# EAGLE design Control_unit (EAGLE 9.4.2)
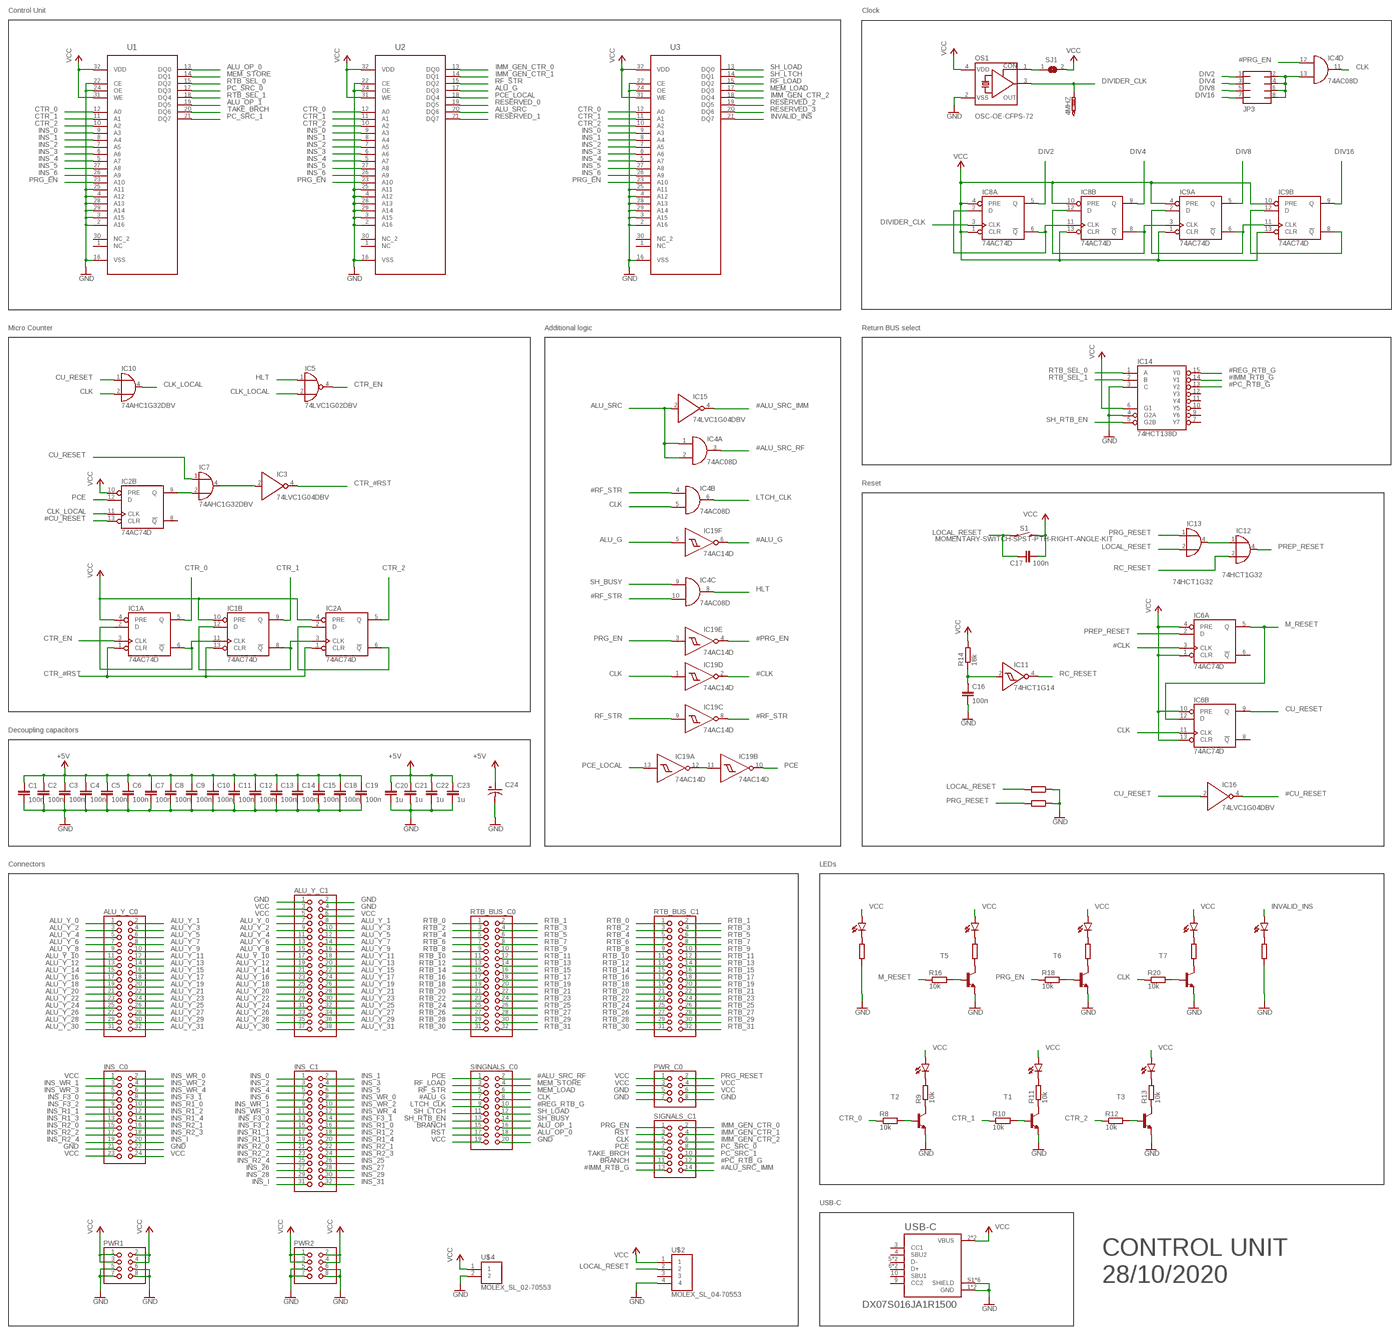
[diagram p0: schematic, sheet 1, overview]
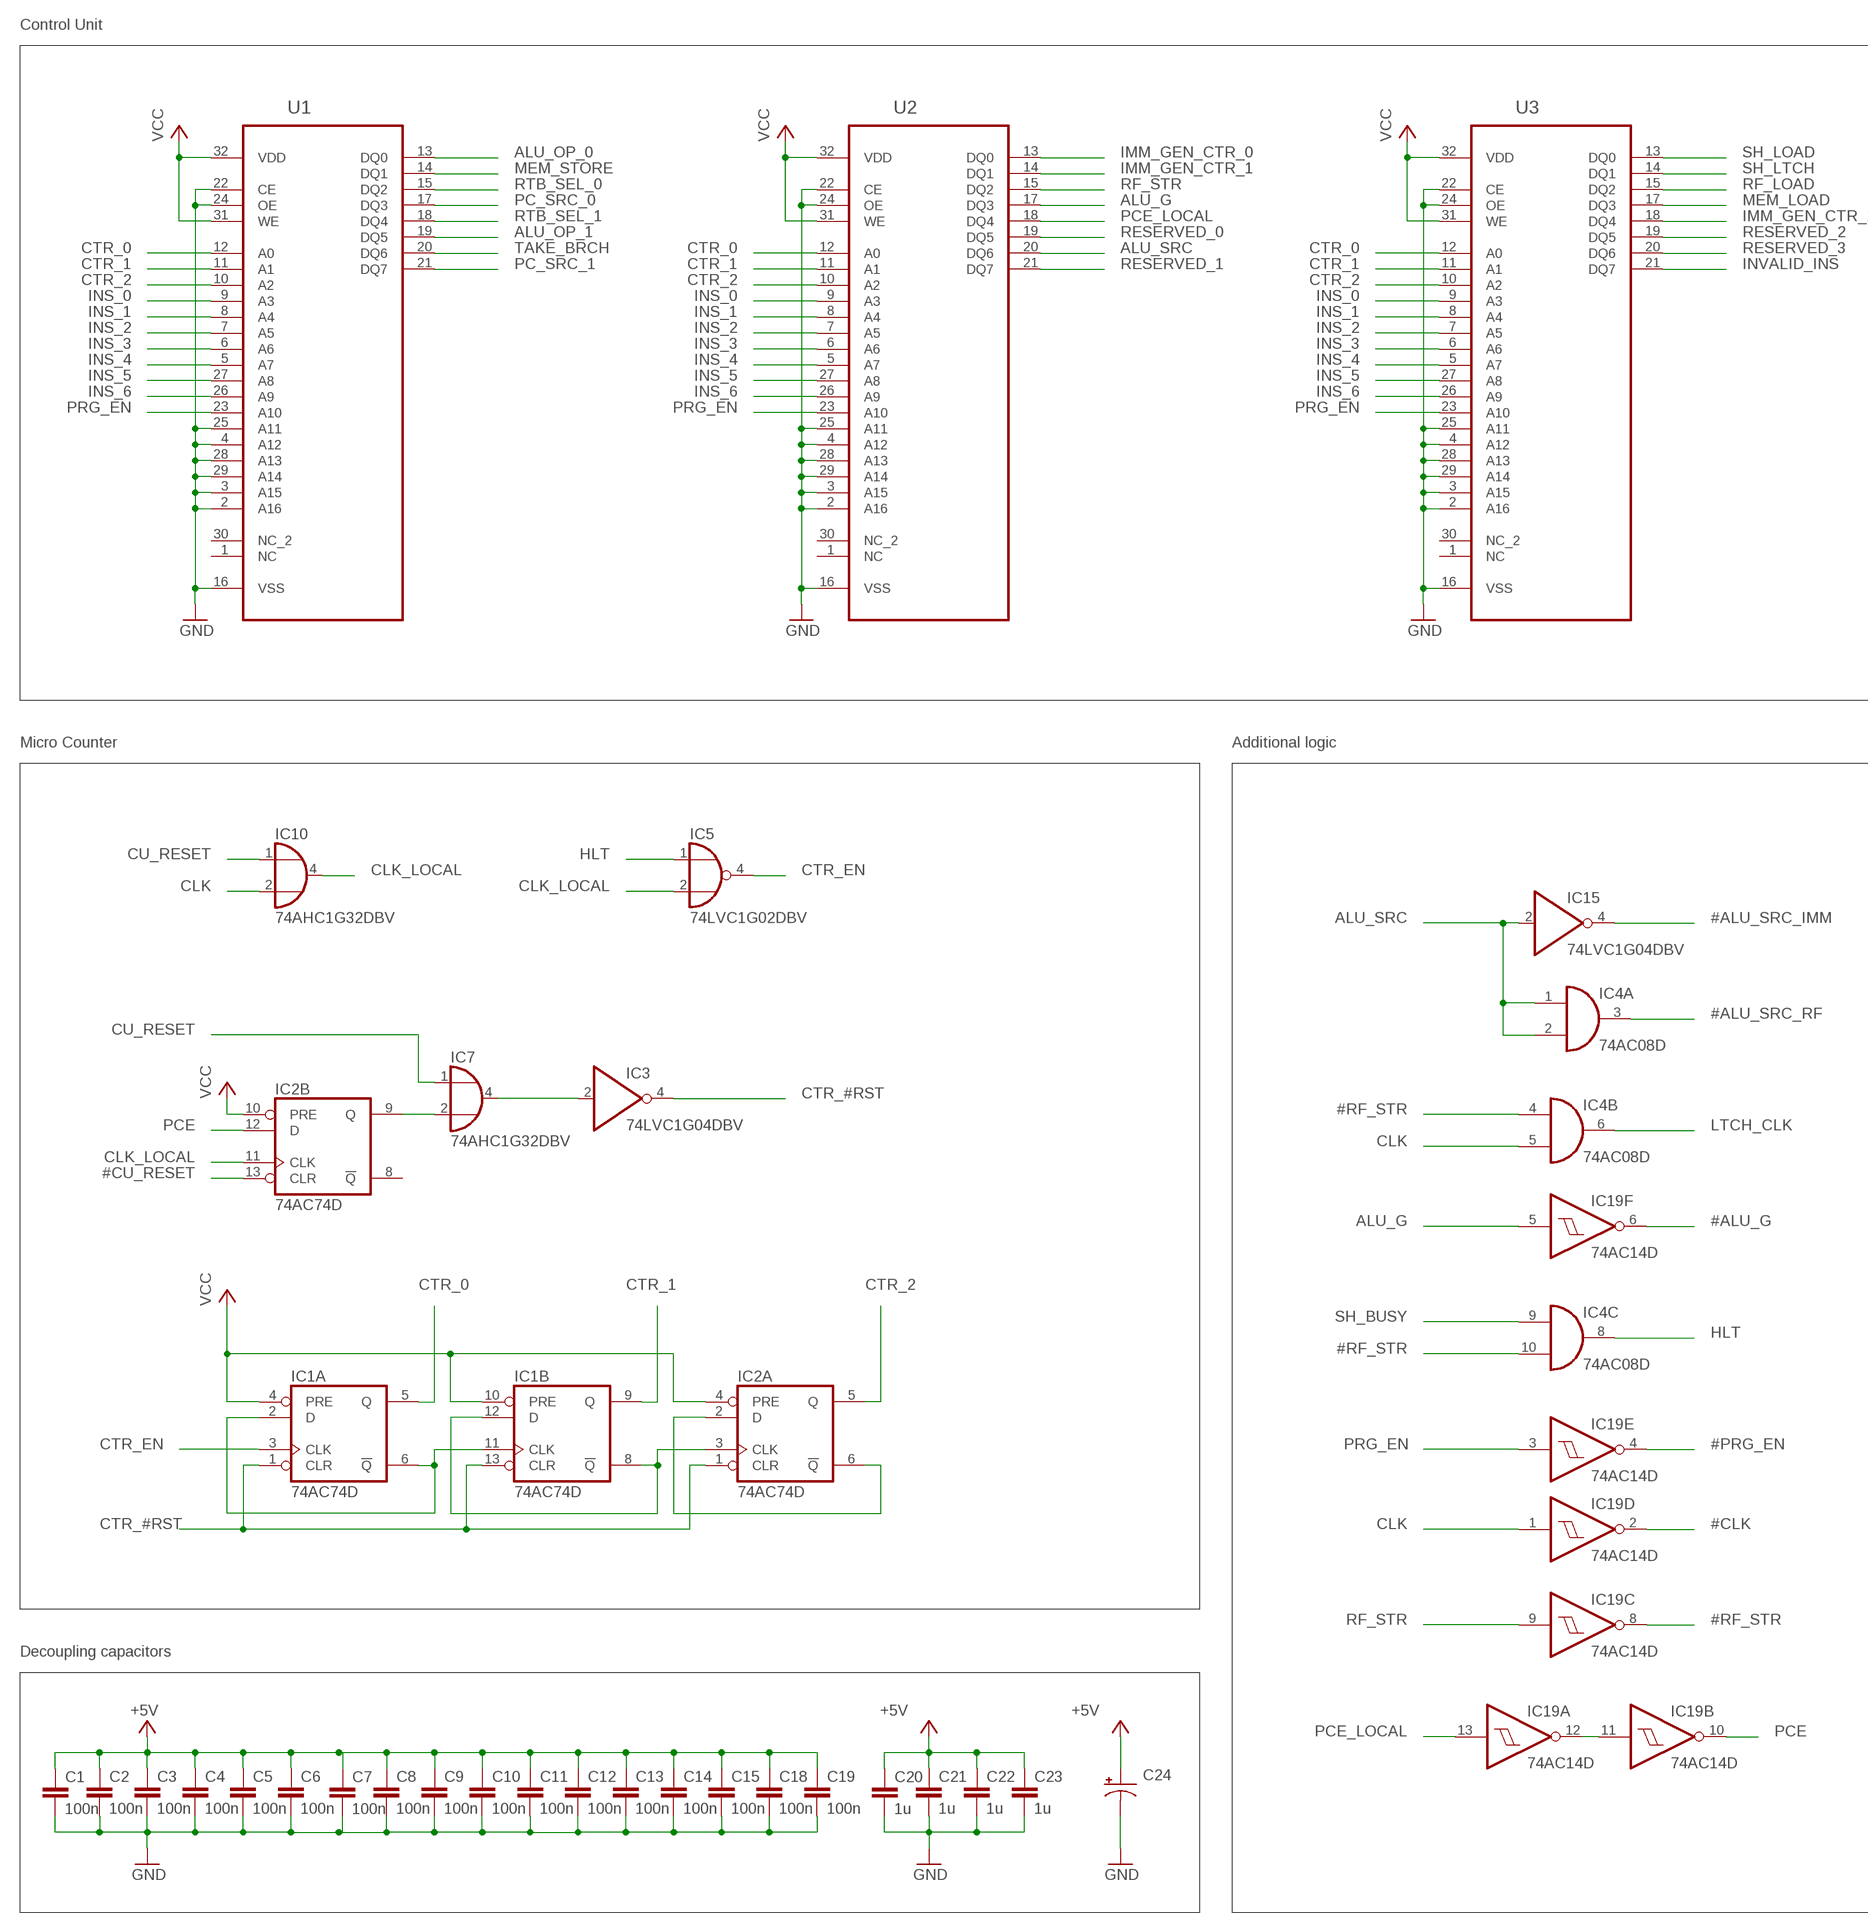
[diagram p1: schematic, sheet 1, part 1 of 4]
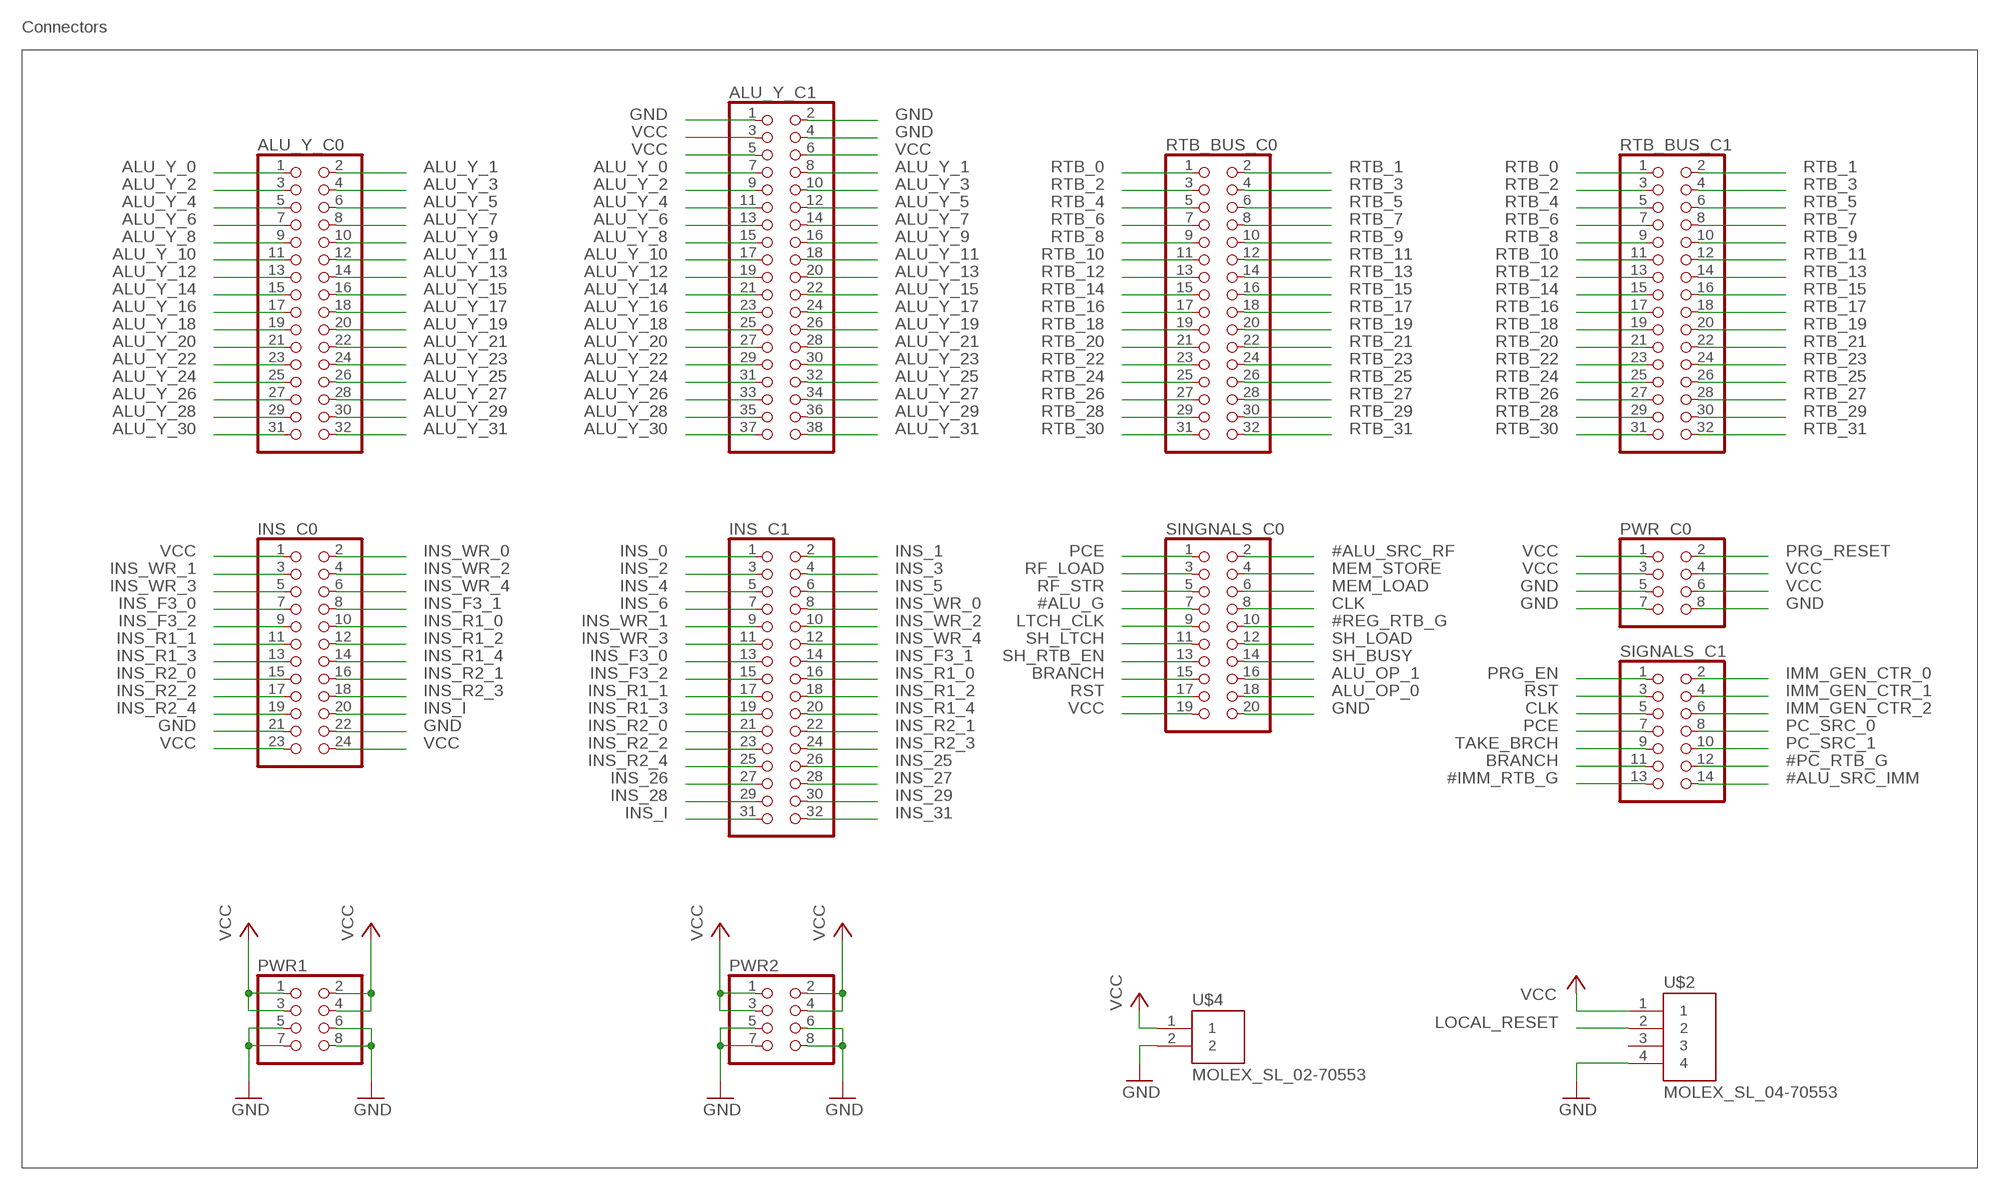
[diagram p2: schematic, sheet 1, part 2 of 4]
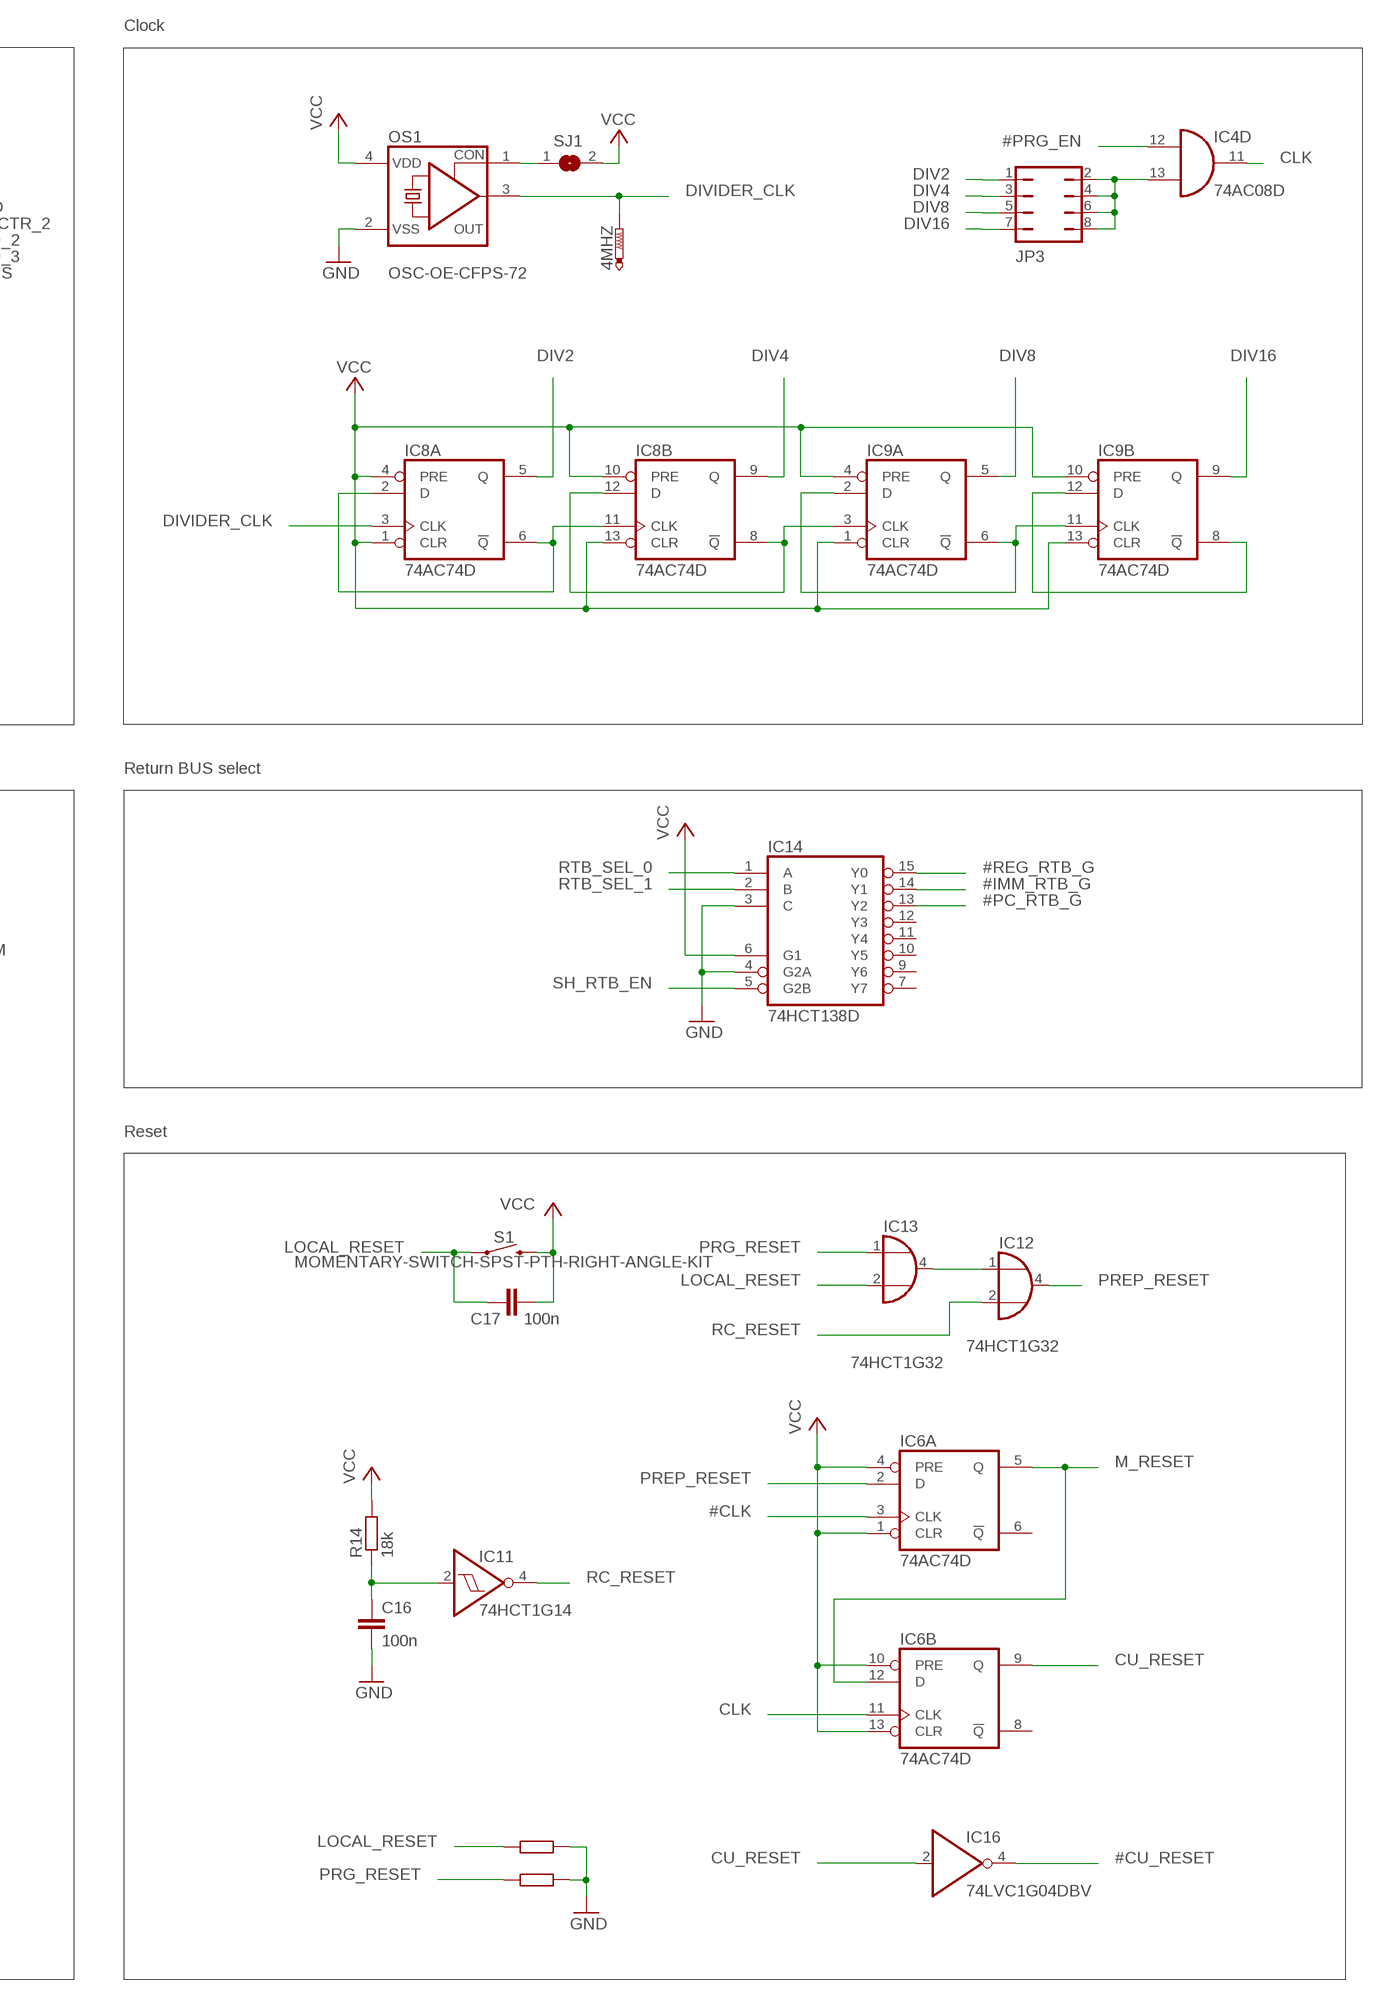
[diagram p3: schematic, sheet 1, part 3 of 4]
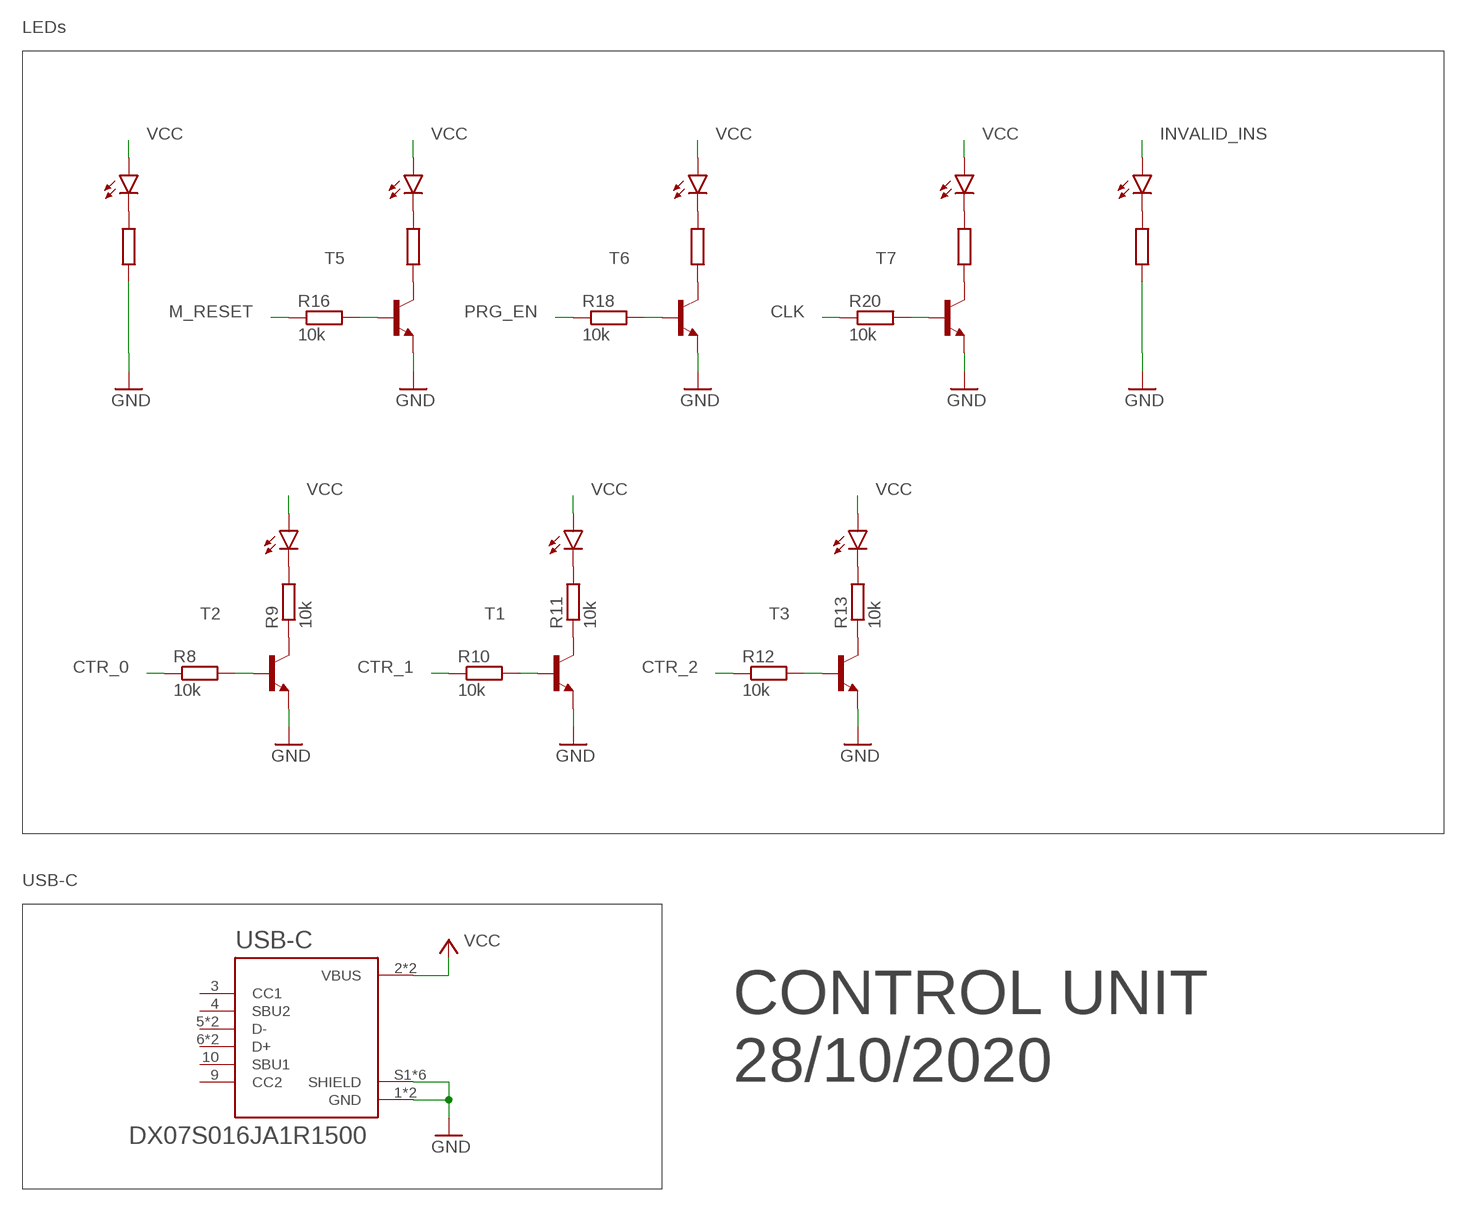
[diagram p4: schematic, sheet 1, part 4 of 4]

## Parts
4MHZ  PTR1B2,54  [B2,54]
ALU_Y_C0  PINHD-2X16  [2X16]
ALU_Y_C1  PINHD-2X19  [2X19]
C1  100n  C-EUC0805  [C0805]
C2  100n  C-EUC0805  [C0805]
C3  100n  C-EUC0805  [C0805]
C4  100n  C-EUC0805  [C0805]
C5  100n  C-EUC0805  [C0805]
C6  100n  C-EUC0805  [C0805]
C7  100n  C-EUC0805  [C0805]
C8  100n  C-EUC0805  [C0805]
C9  100n  C-EUC0805  [C0805]
C10  100n  C-EUC0805  [C0805]
C11  100n  C-EUC0805  [C0805]
C12  100n  C-EUC0805  [C0805]
C13  100n  C-EUC0805  [C0805]
C14  100n  C-EUC0805  [C0805]
C15  100n  C-EUC0805  [C0805]
C16  100n  C-EUC0805  [C0805]
C17  100n  C-EUC0805  [C0805]
C18  100n  C-EUC0805  [C0805]
C19  100n  C-EUC0805  [C0805]
C20  1u  C-EUC0805  [C0805]
C21  1u  C-EUC0805  [C0805]
C22  1u  C-EUC0805  [C0805]
C23  1u  C-EUC0805  [C0805]
C24  CAPACITOR-P153CLV-1010  [153CLV-1010]
IC1  74AC74D  [SO14]
IC2  74AC74D  [SO14]
IC3  74LVC1G04DBV  [SOT23-5]
IC4  74AC08D  [SO14]
IC5  74LVC1G02DBV  [SOT23-5]
IC6  74AC74D  [SO14]
IC7  74AHC1G32DBV  [SOT23-5]
IC8  74AC74D  [SO14]
IC9  74AC74D  [SO14]
IC10  74AHC1G32DBV  [SOT23-5]
IC11  74HCT1G14  74AHC1G14DBV  [SOT23-5]
IC12  74HCT1G32  74AHC1G32DBV  [SOT23-5]
IC13  74HCT1G32  74AHC1G32DBV  [SOT23-5]
IC14  74HCT138D  [SO16]
IC15  74LVC1G04DBV  [SOT23-5]
IC16  74LVC1G04DBV  [SOT23-5]
IC19  74AC14D  [SO14]
INS_C0  PINHD-2X12  [2X12]
INS_C1  PINHD-2X16  [2X16]
JP3  JP4Q  [JP4Q]
LED1  LEDSML0805  [SML0805]
LED2  LEDSML0805  [SML0805]
LED3  LEDSML0805  [SML0805]
LED4  LEDSML0805  [SML0805]
LED5  LEDSML0805  [SML0805]
LED6  LEDSML0805  [SML0805]
LED7  LEDSML0805  [SML0805]
LED8  LEDSML0805  [SML0805]
OS1  OSC-OE-CFPS-72  [7.2X5.2-4-PAD]
PWR1  PINHD-2X4  [2X04]
PWR2  PINHD-2X4  [2X04]
PWR_C0  PINHD-2X4  [2X04]
R1  10k  R-EU_M0805  [M0805]
R2  10k  R-EU_M0805  [M0805]
R3  1k  R-EU_M0805  [M0805]
R4  1k  R-EU_M0805  [M0805]
R5  1k  R-EU_M0805  [M0805]
R6  1k  R-EU_M0805  [M0805]
R7  1k  R-EU_M0805  [M0805]
R8  10k  R-EU_M0805  [M0805]
R9  10k  R-EU_M0805  [M0805]
R10  10k  R-EU_M0805  [M0805]
R11  10k  R-EU_M0805  [M0805]
R12  10k  R-EU_M0805  [M0805]
R13  10k  R-EU_M0805  [M0805]
R14  18k  R-EU_M0805  [M0805]
R16  10k  R-EU_M0805  [M0805]
R18  10k  R-EU_M0805  [M0805]
R20  10k  R-EU_M0805  [M0805]
RTB_BUS_C0  PINHD-2X16  [2X16]
RTB_BUS_C1  PINHD-2X16  [2X16]
S1  MOMENTARY-SWITCH-SPST-PTH-RIGHT-ANGLE-KIT  [TACTILE_SWITCH_PTH_RIGHT_ANGLE_KIT]
SIGNALS_C1  PINHD-2X7  [2X07]
SINGNALS_C0  PINHD-2X10  [2X10]
SJ1  SJ  [SJ]
T1  MMBT4401LT1-NPN-SOT23-BEC  [SOT23-BEC]
T2  MMBT4401LT1-NPN-SOT23-BEC  [SOT23-BEC]
T3  MMBT4401LT1-NPN-SOT23-BEC  [SOT23-BEC]
T5  MMBT4401LT1-NPN-SOT23-BEC  [SOT23-BEC]
T6  MMBT4401LT1-NPN-SOT23-BEC  [SOT23-BEC]
T7  MMBT4401LT1-NPN-SOT23-BEC  [SOT23-BEC]
U1  SST39SF010A-70-4I-NHEPLCC32  [S32]
U2  SST39SF010A-70-4I-NHEPLCC32  [S32]
U3  SST39SF010A-70-4I-NHEPLCC32  [S32]
U$2  MOLEX_SL_04-70553  [SL_70553_4]
U$4  MOLEX_SL_02-70553  [SL_70553_2]
USB-C  DX07S016JA1R1500  [JAE_DX07S016JA1R1500]

## Nets
#ALU_G: IC19.6(F:O) SINGNALS_C0.7
#ALU_SRC_IMM: IC15.4(O) SIGNALS_C1.14
#ALU_SRC_RF: IC4.3(A:O) SINGNALS_C0.2
#CLK: IC6.3(A:CLK) IC19.2(D:O)
#CU_RESET: IC2.13(B:CLR) IC16.4(O)
#IMM_RTB_G: IC14.14(Y1) SIGNALS_C1.13
#PC_RTB_G: IC14.13(Y2) SIGNALS_C1.12
#PRG_EN: IC4.12(D:I0) IC19.4(E:O)
#REG_RTB_G: IC14.15(Y0) SINGNALS_C0.10
#RF_STR: IC4.4(B:I0) IC4.10(C:I1) IC19.8(C:O)
ALU_G: IC19.5(F:I) U2.17(DQ3)
ALU_OP_0: SINGNALS_C0.18 U1.13(DQ0)
ALU_OP_1: SINGNALS_C0.16 U1.19(DQ5)
ALU_SRC: IC4.1(A:I0) IC4.2(A:I1) IC15.2(I) U2.20(DQ6)
ALU_Y_0: ALU_Y_C0.1 ALU_Y_C1.7
ALU_Y_1: ALU_Y_C0.2 ALU_Y_C1.8
ALU_Y_2: ALU_Y_C0.3 ALU_Y_C1.9
ALU_Y_3: ALU_Y_C0.4 ALU_Y_C1.10
ALU_Y_4: ALU_Y_C0.5 ALU_Y_C1.11
ALU_Y_5: ALU_Y_C0.6 ALU_Y_C1.12
ALU_Y_6: ALU_Y_C0.7 ALU_Y_C1.13
ALU_Y_7: ALU_Y_C0.8 ALU_Y_C1.14
ALU_Y_8: ALU_Y_C0.9 ALU_Y_C1.15
ALU_Y_9: ALU_Y_C0.10 ALU_Y_C1.16
ALU_Y_10: ALU_Y_C0.11 ALU_Y_C1.17
ALU_Y_11: ALU_Y_C0.12 ALU_Y_C1.18
ALU_Y_12: ALU_Y_C0.13 ALU_Y_C1.19
ALU_Y_13: ALU_Y_C0.14 ALU_Y_C1.20
ALU_Y_14: ALU_Y_C0.15 ALU_Y_C1.21
ALU_Y_15: ALU_Y_C0.16 ALU_Y_C1.22
ALU_Y_16: ALU_Y_C0.17 ALU_Y_C1.23
ALU_Y_17: ALU_Y_C0.18 ALU_Y_C1.24
ALU_Y_18: ALU_Y_C0.19 ALU_Y_C1.25
ALU_Y_19: ALU_Y_C0.20 ALU_Y_C1.26
ALU_Y_20: ALU_Y_C0.21 ALU_Y_C1.27
ALU_Y_21: ALU_Y_C0.22 ALU_Y_C1.28
ALU_Y_22: ALU_Y_C0.23 ALU_Y_C1.29
ALU_Y_23: ALU_Y_C0.24 ALU_Y_C1.30
ALU_Y_24: ALU_Y_C0.25 ALU_Y_C1.31
ALU_Y_25: ALU_Y_C0.26 ALU_Y_C1.32
ALU_Y_26: ALU_Y_C0.27 ALU_Y_C1.33
ALU_Y_27: ALU_Y_C0.28 ALU_Y_C1.34
ALU_Y_28: ALU_Y_C0.29 ALU_Y_C1.35
ALU_Y_29: ALU_Y_C0.30 ALU_Y_C1.36
ALU_Y_30: ALU_Y_C0.31 ALU_Y_C1.37
ALU_Y_31: ALU_Y_C0.32 ALU_Y_C1.38
BRANCH: SIGNALS_C1.11 SINGNALS_C0.15
CLK: IC4.5(B:I1) IC4.11(D:O) IC6.11(B:CLK) IC10.2(I1) IC19.1(D:I) R20.1 SIGNALS_C1.5 SINGNALS_C0.8
CLK_LOCAL: IC2.11(B:CLK) IC5.2(I1) IC10.4(O)
CTR_0: IC1.5(A:Q) R8.1 U1.12(A0) U2.12(A0) U3.12(A0)
CTR_1: IC1.9(B:Q) R10.1 U1.11(A1) U2.11(A1) U3.11(A1)
CTR_2: IC2.5(A:Q) R12.1 U1.10(A2) U2.10(A2) U3.10(A2)
CTR_#RST: IC1.1(A:CLR) IC1.13(B:CLR) IC2.1(A:CLR) IC3.4(O)
CTR_EN: IC1.3(A:CLK) IC5.4(O)
CU_RESET: IC6.9(B:Q) IC7.1(I0) IC10.1(I0) IC16.2(I)
DIV2: IC8.5(A:Q) JP3.1
DIV4: IC8.9(B:Q) JP3.3
DIV8: IC9.5(A:Q) JP3.5
DIV16: IC9.9(B:Q) JP3.7
DIVIDER_CLK: 4MHZ.TP IC8.3(A:CLK) OS1.3(OUT)
GND: ALU_Y_C1.1 ALU_Y_C1.2 ALU_Y_C1.4 C1.2 C2.2 C3.2 C4.2 C5.2 C6.2 C7.2 C8.2 C9.2 C10.2 C11.2 C12.2 C13.2 C14.2 C15.2 C16.2 C18.2 C19.2 C20.2 C21.2 C22.2 C23.2 C24.- IC14.3(C) IC14.4(G2A) INS_C0.21 INS_C0.22 OS1.2(VSS) PWR1.5 PWR1.6 PWR1.7 PWR1.8 PWR2.5 PWR2.6 PWR2.7 PWR2.8 PWR_C0.5 PWR_C0.7 PWR_C0.8 R1.1 R2.1 R3.1 R7.1 SINGNALS_C0.20 T1.E T2.E T3.E T5.E T6.E T7.E U1.2(A16) U1.3(A15) U1.4(A12) U1.16(VSS) U1.22(CE) U1.24(OE) U1.25(A11) U1.28(A13) U1.29(A14) U2.2(A16) U2.3(A15) U2.4(A12) U2.16(VSS) U2.22(CE) U2.24(OE) U2.25(A11) U2.28(A13) U2.29(A14) U3.2(A16) U3.3(A15) U3.4(A12) U3.16(VSS) U3.22(CE) U3.24(OE) U3.25(A11) U3.28(A13) U3.29(A14) U$2.4 U$4.2 USB-C.1(GND) USB-C.12(GND) USB-C.S1(SHIELD) USB-C.S2(SHIELD) USB-C.S3(SHIELD) USB-C.S4(SHIELD) USB-C.S5(SHIELD) USB-C.S6(SHIELD)
HLT: IC4.8(C:O) IC5.1(I0)
IMM_GEN_CTR_0: SIGNALS_C1.2 U2.13(DQ0)
IMM_GEN_CTR_1: SIGNALS_C1.4 U2.14(DQ1)
IMM_GEN_CTR_2: SIGNALS_C1.6 U3.18(DQ4)
INS_0: INS_C1.1 U1.9(A3) U2.9(A3) U3.9(A3)
INS_1: INS_C1.2 U1.8(A4) U2.8(A4) U3.8(A4)
INS_2: INS_C1.3 U1.7(A5) U2.7(A5) U3.7(A5)
INS_3: INS_C1.4 U1.6(A6) U2.6(A6) U3.6(A6)
INS_4: INS_C1.5 U1.5(A7) U2.5(A7) U3.5(A7)
INS_5: INS_C1.6 U1.27(A8) U2.27(A8) U3.27(A8)
INS_6: INS_C1.7 U1.26(A9) U2.26(A9) U3.26(A9)
INS_25: INS_C1.26
INS_26: INS_C1.27
INS_27: INS_C1.28
INS_28: INS_C1.29
INS_29: INS_C1.30
INS_31: INS_C1.32
INS_F3_0: INS_C0.7 INS_C1.13
INS_F3_1: INS_C0.8 INS_C1.14
INS_F3_2: INS_C0.9 INS_C1.15
INS_I: INS_C0.20 INS_C1.31
INS_R1_0: INS_C0.10 INS_C1.16
INS_R1_1: INS_C0.11 INS_C1.17
INS_R1_2: INS_C0.12 INS_C1.18
INS_R1_3: INS_C0.13 INS_C1.19
INS_R1_4: INS_C0.14 INS_C1.20
INS_R2_0: INS_C0.15 INS_C1.21
INS_R2_1: INS_C0.16 INS_C1.22
INS_R2_2: INS_C0.17 INS_C1.23
INS_R2_3: INS_C0.18 INS_C1.24
INS_R2_4: INS_C0.19 INS_C1.25
INS_WR_0: INS_C0.2 INS_C1.8
INS_WR_1: INS_C0.3 INS_C1.9
INS_WR_2: INS_C0.4 INS_C1.10
INS_WR_3: INS_C0.5 INS_C1.11
INS_WR_4: INS_C0.6 INS_C1.12
INVALID_INS: LED5.A U3.21(DQ7)
LOCAL_RESET: C17.1 IC13.2(I1) R1.2 S1.1 U$2.2
LTCH_CLK: IC4.6(B:O) SINGNALS_C0.9
M_RESET: IC6.5(A:Q) IC6.12(B:D) R16.1
MEM_LOAD: SINGNALS_C0.6 U3.17(DQ3)
MEM_STORE: SINGNALS_C0.4 U1.14(DQ1)
N$1: IC1.2(A:D) IC1.6(A:!Q) IC1.11(B:CLK)
N$2: IC12.1(I0) IC13.4(O)
N$3: IC2.9(B:Q) IC7.2(I1)
N$4: IC3.2(I) IC7.4(O)
N$5: IC19.11(B:I) IC19.12(A:O)
N$6: IC8.2(A:D) IC8.6(A:!Q) IC8.11(B:CLK)
N$7: IC1.8(B:!Q) IC1.12(B:D) IC2.3(A:CLK)
N$8: R4.1 T5.C
N$9: IC2.2(A:D) IC2.6(A:!Q)
N$10: R5.1 T6.C
N$11: R6.1 T7.C
N$12: LED1.C R3.2
N$14: R8.2 T2.B
N$15: LED8.C R9.2
N$16: IC8.8(B:!Q) IC8.12(B:D) IC9.3(A:CLK)
N$17: LED2.C R4.2
N$18: LED3.C R5.2
N$19: R9.1 T2.C
N$20: R10.2 T1.B
N$21: LED6.C R11.2
N$22: R11.1 T1.C
N$23: R12.2 T3.B
N$24: LED7.C R13.2
N$25: R13.1 T3.C
N$26: R16.2 T5.B
N$27: LED4.C R6.2
N$28: LED5.C R7.2
N$29: R18.2 T6.B
N$30: IC9.2(A:D) IC9.6(A:!Q) IC9.11(B:CLK)
N$31: IC9.8(B:!Q) IC9.12(B:D)
N$32: R20.2 T7.B
N$33: C16.1 IC11.2(I) R14.1
N$34: OS1.1(CON) SJ1.1
N$35: IC4.13(D:I1) JP3.2 JP3.4 JP3.6 JP3.8
PC_SRC_0: SIGNALS_C1.8 U1.17(DQ3)
PC_SRC_1: SIGNALS_C1.10 U1.21(DQ7)
PCE: IC2.12(B:D) IC19.10(B:O) SIGNALS_C1.7 SINGNALS_C0.1
PCE_LOCAL: IC19.13(A:I) U2.18(DQ4)
PREP_RESET: IC6.2(A:D) IC12.4(O)
PRG_EN: IC19.3(E:I) R18.1 SIGNALS_C1.1 U1.23(A10) U2.23(A10) U3.23(A10)
PRG_RESET: IC13.1(I0) PWR_C0.2 R2.2
RC_RESET: IC11.4(O) IC12.2(I1)
RESERVED_0: U2.19(DQ5)
RESERVED_1: U2.21(DQ7)
RESERVED_2: U3.19(DQ5)
RESERVED_3: U3.20(DQ6)
RF_LOAD: SINGNALS_C0.3 U3.15(DQ2)
RF_STR: IC19.9(C:I) SINGNALS_C0.5 U2.15(DQ2)
RST: SIGNALS_C1.3 SINGNALS_C0.17
RTB_0: RTB_BUS_C0.1 RTB_BUS_C1.1
RTB_1: RTB_BUS_C0.2 RTB_BUS_C1.2
RTB_2: RTB_BUS_C0.3 RTB_BUS_C1.3
RTB_3: RTB_BUS_C0.4 RTB_BUS_C1.4
RTB_4: RTB_BUS_C0.5 RTB_BUS_C1.5
RTB_5: RTB_BUS_C0.6 RTB_BUS_C1.6
RTB_6: RTB_BUS_C0.7 RTB_BUS_C1.7
RTB_7: RTB_BUS_C0.8 RTB_BUS_C1.8
RTB_8: RTB_BUS_C0.9 RTB_BUS_C1.9
RTB_9: RTB_BUS_C0.10 RTB_BUS_C1.10
RTB_10: RTB_BUS_C0.11 RTB_BUS_C1.11
RTB_11: RTB_BUS_C0.12 RTB_BUS_C1.12
RTB_12: RTB_BUS_C0.13 RTB_BUS_C1.13
RTB_13: RTB_BUS_C0.14 RTB_BUS_C1.14
RTB_14: RTB_BUS_C0.15 RTB_BUS_C1.15
RTB_15: RTB_BUS_C0.16 RTB_BUS_C1.16
RTB_16: RTB_BUS_C0.17 RTB_BUS_C1.17
RTB_17: RTB_BUS_C0.18 RTB_BUS_C1.18
RTB_18: RTB_BUS_C0.19 RTB_BUS_C1.19
RTB_19: RTB_BUS_C0.20 RTB_BUS_C1.20
RTB_20: RTB_BUS_C0.21 RTB_BUS_C1.21
RTB_21: RTB_BUS_C0.22 RTB_BUS_C1.22
RTB_22: RTB_BUS_C0.23 RTB_BUS_C1.23
RTB_23: RTB_BUS_C0.24 RTB_BUS_C1.24
RTB_24: RTB_BUS_C0.25 RTB_BUS_C1.25
RTB_25: RTB_BUS_C0.26 RTB_BUS_C1.26
RTB_26: RTB_BUS_C0.27 RTB_BUS_C1.27
RTB_27: RTB_BUS_C0.28 RTB_BUS_C1.28
RTB_28: RTB_BUS_C0.29 RTB_BUS_C1.29
RTB_29: RTB_BUS_C0.30 RTB_BUS_C1.30
RTB_30: RTB_BUS_C0.31 RTB_BUS_C1.31
RTB_31: RTB_BUS_C0.32 RTB_BUS_C1.32
RTB_SEL_0: IC14.1(A) U1.15(DQ2)
RTB_SEL_1: IC14.2(B) U1.18(DQ4)
SH_BUSY: IC4.9(C:I0) SINGNALS_C0.14
SH_LOAD: SINGNALS_C0.12 U3.13(DQ0)
SH_LTCH: SINGNALS_C0.11 U3.14(DQ1)
SH_RTB_EN: IC14.5(G2B) SINGNALS_C0.13
TAKE_BRCH: SIGNALS_C1.9 U1.20(DQ6)
VCC: ALU_Y_C1.3 ALU_Y_C1.5 ALU_Y_C1.6 C1.1 C2.1 C3.1 C4.1 C5.1 C6.1 C7.1 C8.1 C9.1 C10.1 C11.1 C12.1 C13.1 C14.1 C15.1 C17.2 C18.1 C19.1 C20.1 C21.1 C22.1 C23.1 C24.+ IC1.4(A:PRE) IC1.10(B:PRE) IC2.4(A:PRE) IC2.10(B:PRE) IC6.1(A:CLR) IC6.4(A:PRE) IC6.10(B:PRE) IC6.13(B:CLR) IC8.1(A:CLR) IC8.4(A:PRE) IC8.10(B:PRE) IC8.13(B:CLR) IC9.1(A:CLR) IC9.4(A:PRE) IC9.10(B:PRE) IC9.13(B:CLR) IC14.6(G1) INS_C0.1 INS_C0.23 INS_C0.24 LED1.A LED2.A LED3.A LED4.A LED6.A LED7.A LED8.A OS1.4(VDD) PWR1.1 PWR1.2 PWR1.3 PWR1.4 PWR2.1 PWR2.2 PWR2.3 PWR2.4 PWR_C0.1 PWR_C0.3 PWR_C0.4 PWR_C0.6 R14.2 S1.2 SINGNALS_C0.19 SJ1.2 U1.31(WE) U1.32(VDD) U2.31(WE) U2.32(VDD) U3.31(WE) U3.32(VDD) U$2.1 U$4.1 USB-C.2(VBUS) USB-C.11(VBUS) ; supply symbol labelled +5V
Unconnected: IC2.8(B:!Q) IC6.6(A:!Q) IC6.8(B:!Q) IC14.7(Y7) IC14.9(Y6) IC14.10(Y5) IC14.11(Y4) IC14.12(Y3) U1.1(NC) U1.30(NC_2) U2.1(NC) U2.30(NC_2) U3.1(NC) U3.30(NC_2) U$2.3 USB-C.3(CC1) USB-C.4(SBU2) USB-C.5(D-) USB-C.6(D+) USB-C.7(D+) USB-C.8(D-) USB-C.9(CC2) USB-C.10(SBU1)

## Notes on the sheet
- Control Unit | Clock
- Micro Counter | Additional logic | Return BUS select
- Reset
- Decoupling capacitors
- Connectors | LEDs
- USB-C
- CONTROL UNIT
  28/10/2020

## Power pins joined to a net without a drawn wire
GND: IC1.7(P:GND) IC2.7(P:GND) IC3.3(GND) IC4.7(P:GND) IC5.3(GND) IC6.7(P:GND) IC7.3(GND) IC8.7(P:GND) IC9.7(P:GND) IC10.3(GND) IC11.3(GND) IC12.3(GND) IC13.3(GND) IC14.8(GND) IC15.3(GND) IC16.3(GND) IC19.7(P:GND)
VCC: IC1.14(P:VCC) IC2.14(P:VCC) IC3.5(VCC) IC4.14(P:VCC) IC5.5(VCC) IC6.14(P:VCC) IC7.5(VCC) IC8.14(P:VCC) IC9.14(P:VCC) IC10.5(VCC) IC11.5(VCC) IC12.5(VCC) IC13.5(VCC) IC14.16(VCC) IC15.5(VCC) IC16.5(VCC) IC19.14(P:VCC)

## Library data of the parts
4MHZ = testpad:PTR1: TEST PIN
ALU_Y_C0 RTB_BUS_C1 = pinhead:PINHD-2X16: PIN HEADER
ALU_Y_C1 = pinhead_bottom:PINHD-2X19: PIN HEADER
C1-C23 = rcl:C-EU: CAPACITOR, European symbol; SPICEPREFIX: C
C24 = BeagleBone_Blue_R3:CAPACITOR-P: POLARIZED CAPACITOR, American symbol
IC1 IC2 IC6 IC8 IC9 = AAA__74xx-eu:74*74: Dual D type positive edge triggered FLIP FLOP, preset and clear
IC3 IC15 IC16 = 74xx-little-de:74*1G04: INVERTER Gate
IC4 = 74xx-eu:74*08: Quad 2-input AND gate
IC5 = 74xx-little-de:74*1G02: 2-input NOR gate
IC7 IC10 IC12 IC13 = 74xx-little-de:74*1G32: 2-input OR gate
IC11 = 74xx-little-de:74*1G14: Single Schmitt-Trigger Inverter Gate
IC14 = 74xx-eu:74*138: 3-line to 8-line DECODER/DEMULTIPLEXER
IC19 = 74xx-eu:74*14: Hex schmitt trigger INVERTER
INS_C0 = pinhead:PINHD-2X12: PIN HEADER
INS_C1 RTB_BUS_C0 = pinhead_bottom:PINHD-2X16: PIN HEADER
JP3 = jumper:JP4Q: JUMPER
LED1-LED8 = led:LED: LED OSRAM: - CHIPLED LG R971, LG N971, LY N971, LG Q971, LY Q971, LO R971, LY R971 LH N974, LH R974 LS Q976, LO Q976, LY Q976 LO Q996 - Hyper CHIPLED LW Q18S LB Q993, LB Q99A, LB R99A - SideLED LS A670, LO A670, LY A670, LG A670, LP A670 LB A673, LV A673, LT A673, LW A673 LH A674 LY A675 LS A676, LA A676, LO A676, LY A676, LW A676 LS A679, LY A679, LG A679 - Hyper Micro SIDELED® LS Y876, LA Y876, LO Y876, LY Y876 LT Y87S - SmartLED LW L88C, LW L88S LB L89C, LB L89S, LG L890 LS L89K, LO L89K, LY L89K LS L896, LA L896, LO L896, LY L896 - TOPLED LS T670, LO T670, LY T670, LG T670, LP T670 LSG T670, LSP T670, LSY T670, LOP T670, LYG T670 LG T671, LOG T671, LSG T671 LB T673, LV T673, LT T673, LW T673 LH T674 LS T676, LA T676, LO T676, LY T676, LB T676, LH T676, LSB T676, LW T676 LB T67C, LV T67C, LT T67C, LS T67K, LO T67K, LY T67K, LW E67C LS E67B, LA E67B, LO E67B, LY E67B, LB E67C, LV E67C, LT E67C LW T67C LS T679, LY T679, LG T679 LS T770, LO T770, LY T770, LG T770, LP T770 LB T773, LV T773, LT T773, LW T773 LH T774 LS E675, LA E675, LY E675, LS T675 LS T776, LA T776, LO T776, LY T776, LB T776 LHGB T686 LT T68C, LB T68C - Hyper Mini TOPLED® LB M676 - Mini TOPLED Santana® LG M470 LS M47K, LO M47K, LY M47K Source: http://www.osram.convergy.de LUXEON: - LUMILED® LXK2-PW12-R00, LXK2-PW12-S00, LXK2-PW14-U00, LXK2-PW14-V00 LXK2-PM12-R00, LXK2-PM12-S00, LXK2-PM14-U00 LXK2-PE12-Q00, LXK2-PE12-R00, LXK2-PE12-S00, LXK2-PE14-T00, LXK2-PE14-U00 LXK2-PB12-K00, LXK2-PB12-L00, LXK2-PB12-M00, LXK2-PB14-N00, LXK2-PB14-P00, LXK2-PB14-Q00 LXK2-PR12-L00, LXK2-PR12-M00, LXK2-PR14-Q00, LXK2-PR14-R00 LXK2-PD12-Q00, LXK2-PD12-R00, LXK2-PD12-S00 LXK2-PH12-R00, LXK2-PH12-S00 LXK2-PL12-P00, LXK2-PL12-Q00, LXK2-PL12-R00 Source: www.luxeon.com KINGBRIGHT: KA-3528ASYC Source: www.kingbright.com
OS1 = IQD-Frequency-Products:OSC-OE: OSCILLATOR WITH OE
PWR1 PWR2 = pinhead:PINHD-2X4: PIN HEADER
PWR_C0 = pinhead_bottom:PINHD-2X4: PIN HEADER
R1-R14 R16 R18 R20 = rcl:R-EU_: RESISTOR, European symbol; SPICEPREFIX: R
S1 = SparkFun-Switches:MOMENTARY-SWITCH-SPST: Momentary Switch (Pushbutton) - SPST Normally-open (NO) SPST momentary switches (buttons, pushbuttons). Variants PTH-12MM - 12mm square, through-hole Momentary Pushbutton Switch - 12mm Square <https://www.sparkfun.com/products/9190> (COM-09190) PTH-6.0MM, PTH-6.0MM-KIT - 6.0mm square, through-hole Mini Pushbutton Switch <https://www.sparkfun.com/products/97> (COM-00097) KIT package intended for soldering kit's - only one side of pads' copper is exposed. PTH-RIGHT-ANGLE-KIT - Right-angle, through-hole Right Angle Tactile Button <https://www.sparkfun.com/products/10791> - Used on SparkFun BigTime Watch Kit <https://www.sparkfun.com/products/11734> SMD-12MM - 12mm square, surface-mount Tactile Button - SMD (12mm) <https://www.sparkfun.com/products/12993> (COM-12993) Used on SparkFun PicoBoard <https://www.sparkfun.com/products/11888> SMD-4.5MM - 4.5mm Square Trackball Switch Used on SparkFun Blackberry Trackballer Breakout <https://www.sparkfun.com/products/13169> SMD-4.6MMX2.8MM - 4.60mm x 2.80mm, surface mount Used on SparkFun SAMD21 Mini Breakout <https://www.sparkfun.com/products/13664> SMD-5.2MM, SMD-5.2-REDUNDANT - 5.2mm square, surface-mount Mini Pushbutton Switch - SMD <https://www.sparkfun.com/products/8720> (COM-08720) Used on Arduino Pro Mini <https://www.sparkfun.com/products/11114> REDUNDANT package connects both switch circuits together SMD-6.0X3.5MM - 6.0 x 3.5mm, surface mount Momentary Reset Switch SMD <https://www.sparkfun.com/products/8229> (COM-08229) SMD-6.2MM-TALL - 6.2mm square, surface mount Tactile Button - SMD (6mm) <https://www.sparkfun.com/products/12992> Used on SparkFun Digital Sandbox <https://www.sparkfun.com/products/12651> SMD-RIGHT-ANGLE - Right-angle, surface mount Used on SparkFun Block for Intel® Edison - Arduino <https://www.sparkfun.com/products/13036>; PROD_ID: CONN-10672; SF_SKU: COM-10791
SIGNALS_C1 = pinhead_bottom:PINHD-2X7: PIN HEADER
SINGNALS_C0 = pinhead:PINHD-2X10: PIN HEADER
SJ1 = jumper:SJ: SMD solder JUMPER
T1-T3 T5-T7 = transistor:*-NPN-: NPN Transistror BF959 corrected 2008.03.06
U1-U3 = SST39SF010A-70-4I-NHE:SST39SF010A-70-4I-NHE: 1MB Flash
U$2 = molex-sl-connectors_jw:MOLEX_SL_04: Molex SL-Series PCB Header, 4-Pos, 0.1" (2.54mm) Centers
U$4 = molex-sl-connectors_jw:MOLEX_SL_02: Molex SL-Series PCB Header, 2-Pos, 0.1" (2.54mm) Centers
USB-C = DX07S016JA1R1500:DX07S016JA1R1500: USB-C (USB TYPE-C) USB 2.0 Receptacle Connector 24 (16+8 Dummy) Position Surface Mount, Right Angle; Through Hole Check prices <https://pricing.snapeda.com/parts/DX07S016JA1R1500/JAE%20Electronics/view-part?ref=eda>; AVAILABILITY: Warning; DESCRIPTION: USB-C (USB TYPE-C) USB 2.0 Receptacle Connector 24 (16+8 Dummy) Position Surface Mount, Right Angle; Through Hole; MF: JAE Electronics; MP: DX07S016JA1R1500; PACKAGE: None; PRICE: None; PURCHASE-URL: https://pricing.snapeda.com/search/part/DX07S016JA1R1500/?ref=eda

## Board
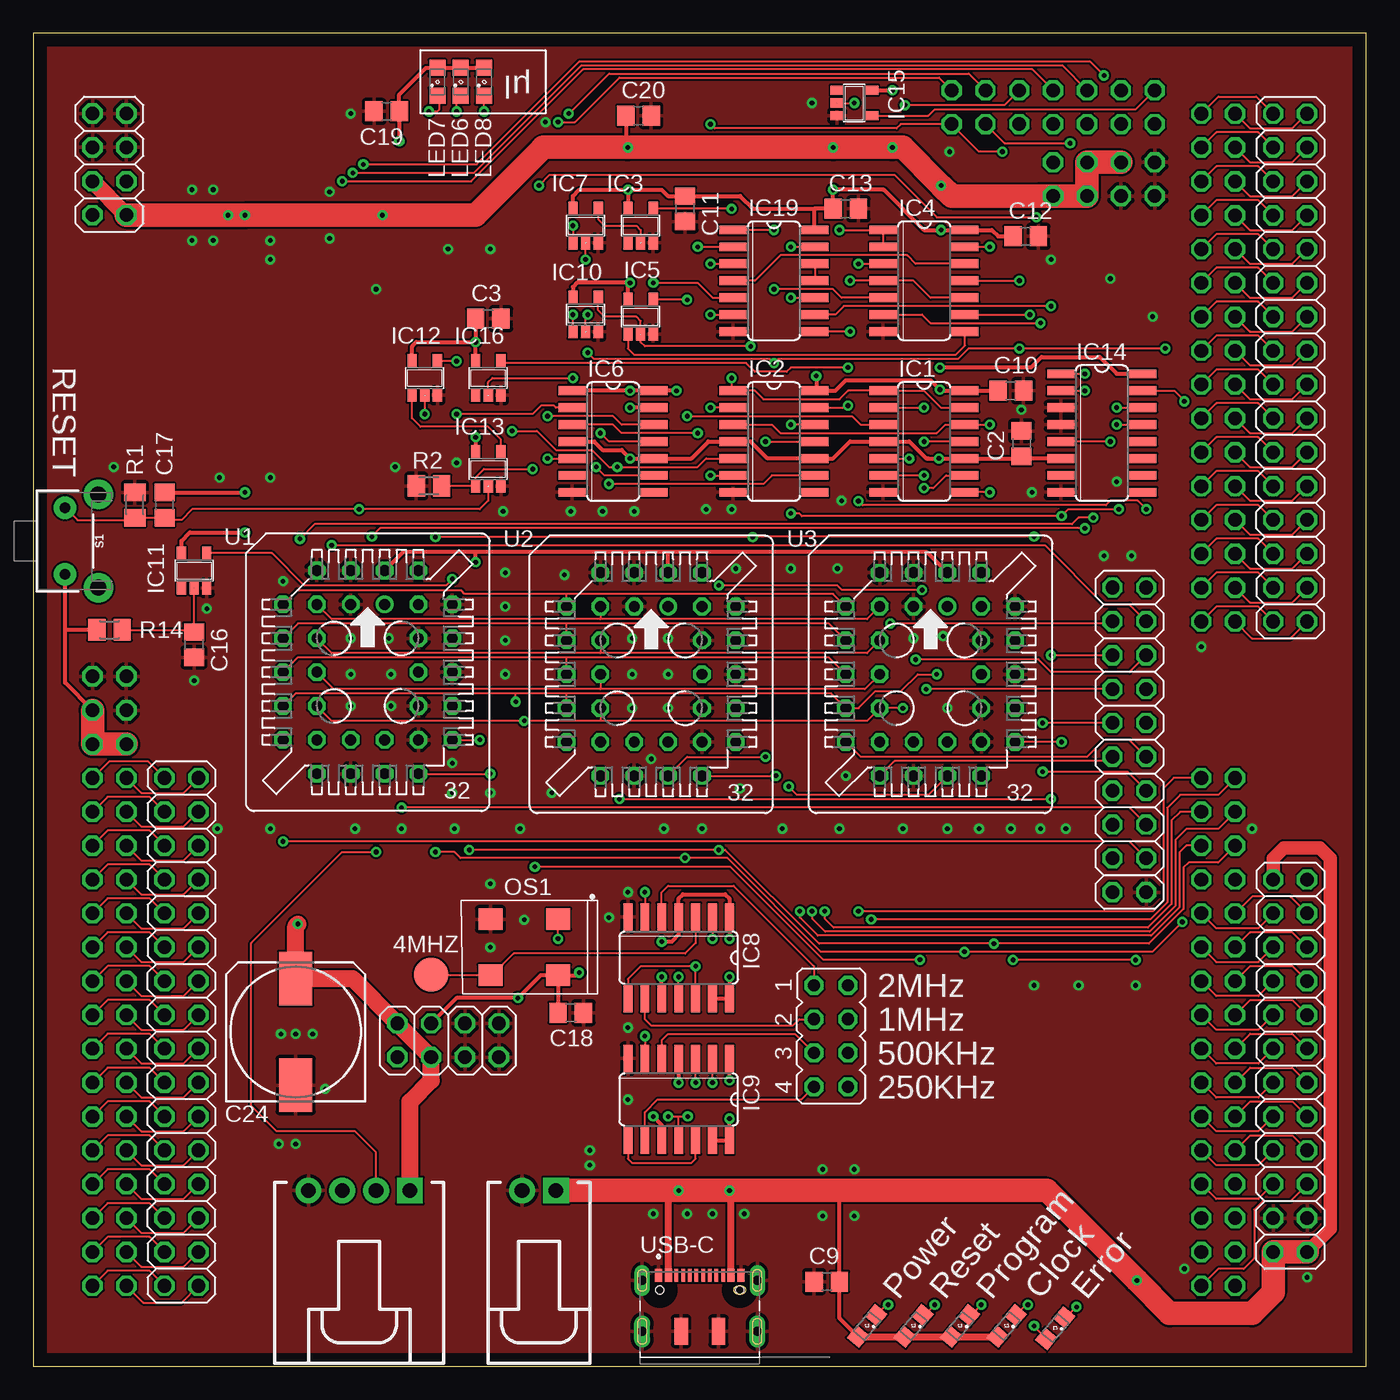
[diagram p5: board, top side]
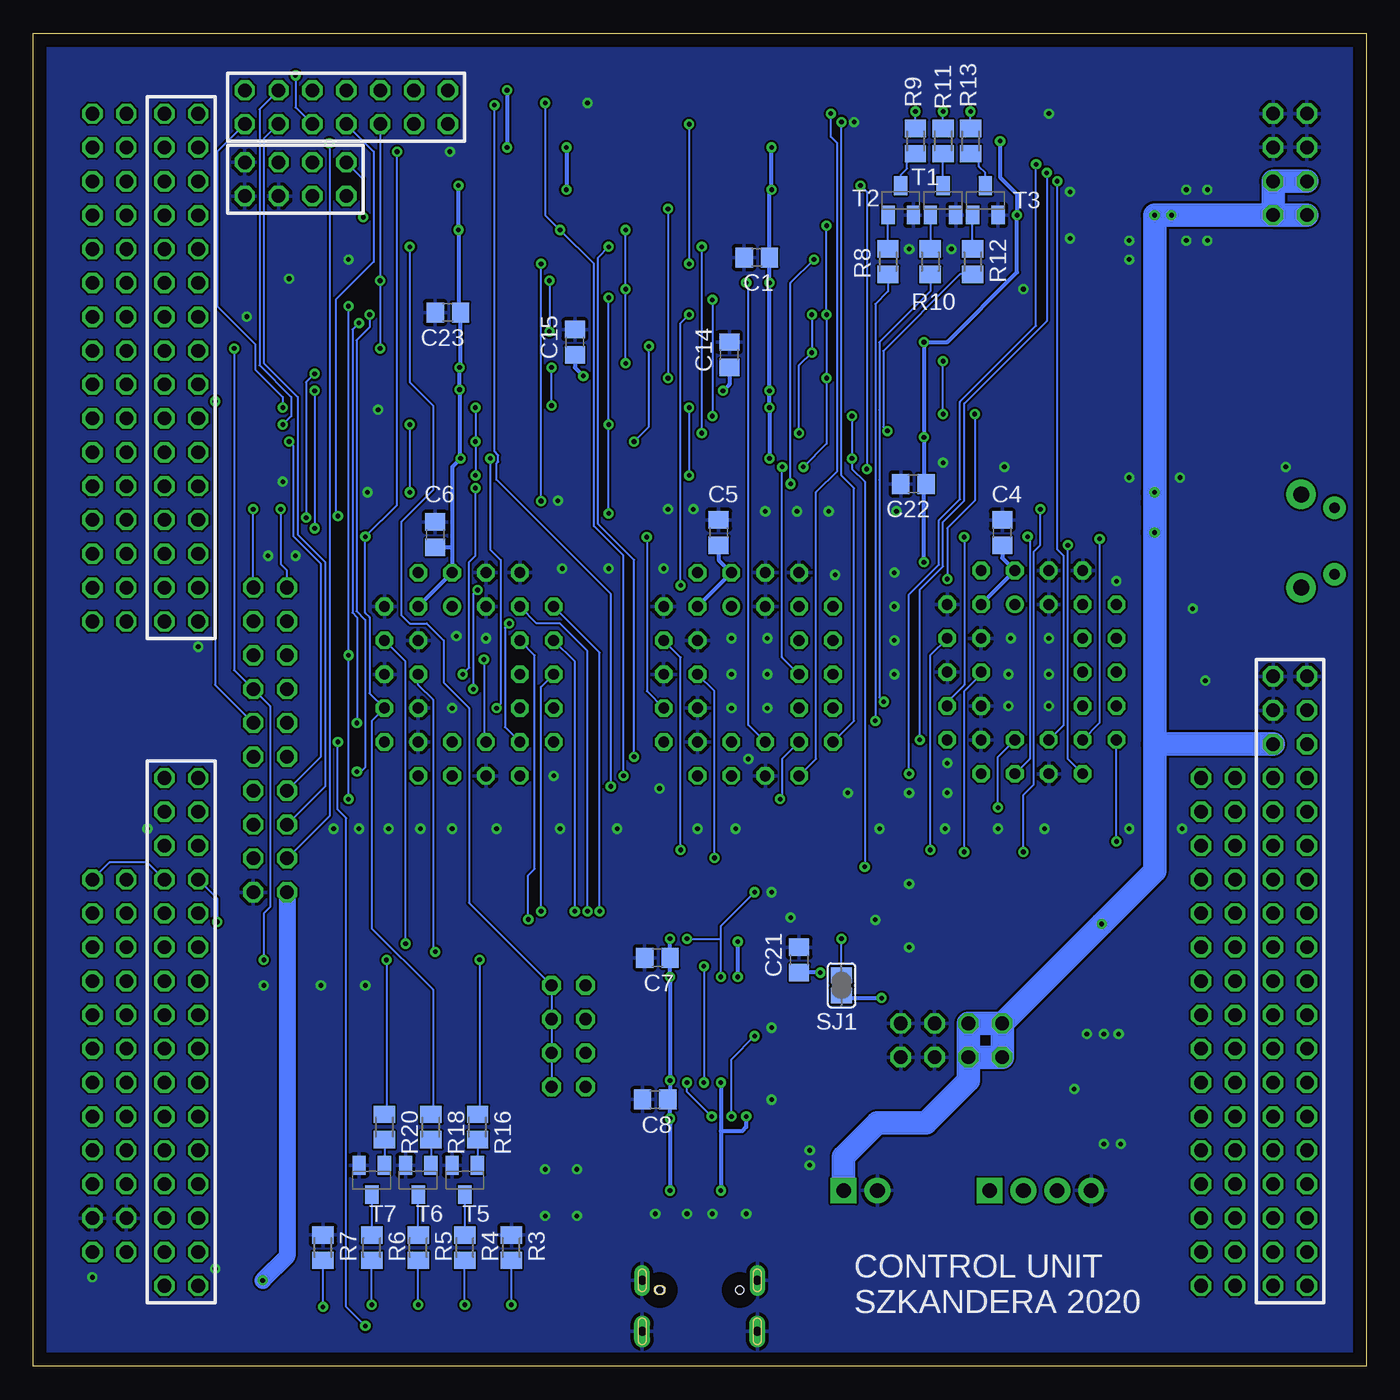
[diagram p6: board, bottom side, seen from below]

Size 100 x 100 mm. Coordinates in mm from the lower left corner, seen from the top.
Outline: 0,0 100,0 100,100 0,100 0,0
Copper layers (1*16): Top 0.035mm / dielectric 1.5mm / Bottom 0.035mm
Design rules "default": minimum track width 6mil, minimum drill 0.35mm, track to track 6mil, track to pad 6mil, pad to pad 6mil, via to via 6mil, smd to smd 6mil, copper to edge 40mil, drill to drill 6mil, minimum pad ring 10mil, minimum via ring 8mil, stop-mask expansion 4mil, vias tented up to drill 0mil, thermal gap 10mil

### Footprints (pad centres in the part's own frame; a part is rotated, then mirrored left to right if it is on the bottom)
B2,54 = smd 2.54 x 2.54: TP 0,0
2X16 = drill 1.016 octagon: 1 -19.05,-1.27; 2 -19.05,1.27; 3 -16.51,-1.27; 4 -16.51,1.27; 5 -13.97,-1.27; 6 -13.97,1.27; 7 -11.43,-1.27; 8 -11.43,1.27; 9 -8.89,-1.27; 10 -8.89,1.27; 11 -6.35,-1.27; 12 -6.35,1.27; 13 -3.81,-1.27; 14 -3.81,1.27; 15 -1.27,-1.27; 16 -1.27,1.27; 17 1.27,-1.27; 18 1.27,1.27; 19 3.81,-1.27; 20 3.81,1.27; 21 6.35,-1.27; 22 6.35,1.27; 23 8.89,-1.27; 24 8.89,1.27; 25 11.43,-1.27; 26 11.43,1.27; 27 13.97,-1.27; 28 13.97,1.27; 29 16.51,-1.27; 30 16.51,1.27; 31 19.05,-1.27; 32 19.05,1.27
2X19 = drill 1.016 octagon: 1 -22.86,-1.27; 2 -22.86,1.27; 3 -20.32,-1.27; 4 -20.32,1.27; 5 -17.78,-1.27; 6 -17.78,1.27; 7 -15.24,-1.27; 8 -15.24,1.27; 9 -12.7,-1.27; 10 -12.7,1.27; 11 -10.16,-1.27; 12 -10.16,1.27; 13 -7.62,-1.27; 14 -7.62,1.27; 15 -5.08,-1.27; 16 -5.08,1.27; 17 -2.54,-1.27; 18 -2.54,1.27; 19 0,-1.27; 20 0,1.27; 21 2.54,-1.27; 22 2.54,1.27; 23 5.08,-1.27; 24 5.08,1.27; 25 7.62,-1.27; 26 7.62,1.27; 27 10.16,-1.27; 28 10.16,1.27; 29 12.7,-1.27; 30 12.7,1.27; 31 15.24,-1.27; 32 15.24,1.27; 33 17.78,-1.27; 34 17.78,1.27; 35 20.32,-1.27; 36 20.32,1.27; 37 22.86,-1.27; 38 22.86,1.27
C0805 = smd 1.3 x 1.5: 1 -0.95,0; 2 0.95,0
153CLV-1010 = smd 4 x 2.5: + 4,0; - -4,0
SO14 = smd 0.66 x 2.032: 1 -3.81,-3.073; 2 -2.54,-3.073; 3 -1.27,-3.073; 4 0,-3.073; 5 1.27,-3.073; 6 2.54,-3.073; 7 3.81,-3.073; 8 3.81,3.073; 9 2.54,3.073; 10 1.27,3.073; 11 0,3.073; 12 -1.27,3.073; 13 -2.54,3.073; 14 -3.81,3.073
SOT23-5 = smd 0.69 x 0.99: 1 -0.95,-1.29; 2 0,-1.29; 3 0.95,-1.29; 4 0.95,1.3; 5 -0.95,1.3
SO16 = smd 0.66 x 2.032: 1 -4.445,-3.073; 2 -3.175,-3.073; 3 -1.905,-3.073; 4 -0.635,-3.073; 5 0.635,-3.073; 6 1.905,-3.073; 7 3.175,-3.073; 8 4.445,-3.073; 9 4.445,3.073; 10 3.175,3.073; 11 1.905,3.073; 12 0.635,3.073; 13 -0.635,3.073; 14 -1.905,3.073; 15 -3.175,3.073; 16 -4.445,3.073
2X12 = drill 1.016 octagon: 1 -13.97,-1.27; 2 -13.97,1.27; 3 -11.43,-1.27; 4 -11.43,1.27; 5 -8.89,-1.27; 6 -8.89,1.27; 7 -6.35,-1.27; 8 -6.35,1.27; 9 -3.81,-1.27; 10 -3.81,1.27; 11 -1.27,-1.27; 12 -1.27,1.27; 13 1.27,-1.27; 14 1.27,1.27; 15 3.81,-1.27; 16 3.81,1.27; 17 6.35,-1.27; 18 6.35,1.27; 19 8.89,-1.27; 20 8.89,1.27; 21 11.43,-1.27; 22 11.43,1.27; 23 13.97,-1.27; 24 13.97,1.27
JP4Q = drill 0.914 octagon: 1 -3.81,-1.27; 2 -3.81,1.27; 3 -1.27,-1.27; 4 -1.27,1.27; 5 1.27,-1.27; 6 1.27,1.27; 7 3.81,-1.27; 8 3.81,1.27
SML0805 = smd 1.2 x 1.2: A 1.05,0; C -1.05,0
7.2X5.2-4-PAD = smd 1.8 x 1.6: 1 -2.54,-2.1; 2 2.54,-2.1; 3 2.54,2.1; 4 -2.54,2.1
2X04 = drill 1.016 octagon: 1 -3.81,-1.27; 2 -3.81,1.27; 3 -1.27,-1.27; 4 -1.27,1.27; 5 1.27,-1.27; 6 1.27,1.27; 7 3.81,-1.27; 8 3.81,1.27
M0805 = smd 1.3 x 1.6: 1 -0.95,0; 2 0.95,0
TACTILE_SWITCH_PTH_RIGHT_ANGLE_KIT = drill 0.8 pad 1.7: 1 -2.5,0; 2 2.5,0 | drill 1.2 pad 2.2: ANCHOR1 -3.5,2.5; ANCHOR2 3.5,2.5
2X07 = drill 1.016 octagon: 1 -7.62,-1.27; 2 -7.62,1.27; 3 -5.08,-1.27; 4 -5.08,1.27; 5 -2.54,-1.27; 6 -2.54,1.27; 7 0,-1.27; 8 0,1.27; 9 2.54,-1.27; 10 2.54,1.27; 11 5.08,-1.27; 12 5.08,1.27; 13 7.62,-1.27; 14 7.62,1.27
2X10 = drill 1.016 octagon: 1 -11.43,-1.27; 2 -11.43,1.27; 3 -8.89,-1.27; 4 -8.89,1.27; 5 -6.35,-1.27; 6 -6.35,1.27; 7 -3.81,-1.27; 8 -3.81,1.27; 9 -1.27,-1.27; 10 -1.27,1.27; 11 1.27,-1.27; 12 1.27,1.27; 13 3.81,-1.27; 14 3.81,1.27; 15 6.35,-1.27; 16 6.35,1.27; 17 8.89,-1.27; 18 8.89,1.27; 19 11.43,-1.27; 20 11.43,1.27
SJ = smd 1.168 x 1.6: 1 -0.762,0; 2 0.762,0
SOT23-BEC = smd 1 x 1.4: B -0.95,-1.1; C 0,1.1; E 0.95,-1.1
S32 = drill 0.813: 1 1.27,5.08 | drill 0.813 octagon: 2 -1.27,7.62; 3 -1.27,5.08; 4 -3.81,7.62; 5 -6.35,5.08; 6 -3.81,5.08; 7 -6.35,2.54; 8 -3.81,2.54; 9 -6.35,0; 10 -3.81,0; 11 -6.35,-2.54; 12 -3.81,-2.54; 13 -6.35,-5.08; 14 -3.81,-7.62; 15 -3.81,-5.08; 16 -1.27,-7.62; 17 -1.27,-5.08; 18 1.27,-7.62; 19 1.27,-5.08; 20 3.81,-7.62; 21 6.35,-5.08; 22 3.81,-5.08; 23 6.35,-2.54; 24 3.81,-2.54; 25 6.35,0; 26 3.81,0; 27 6.35,2.54; 28 3.81,2.54; 29 6.35,5.08; 30 3.81,7.62; 31 3.81,5.08; 32 1.27,7.62
SL_70553_4 = drill 1.1 pad 1.93 square: 1 -3.81,-5.08 | drill 1.1 pad 1.93: 2 -1.27,-5.08; 3 1.27,-5.08; 4 3.81,-5.08
SL_70553_2 = drill 1.1 pad 1.93 square: 1 -1.27,-5.08 | drill 1.1 pad 1.93: 2 1.27,-5.08
JAE_DX07S016JA1R1500 = smd 0.52 x 1: 1 -3.1,1.1; 2 -2.35,1.1; 11 2.35,1.1; 12 3.1,1.1 | smd 0.27 x 1: 3 -1.75,1.1; 4 -1.25,1.1; 5 -0.75,1.1; 6 -0.25,1.1; 7 0.25,1.1; 8 0.75,1.1; 9 1.25,1.1; 10 1.75,1.1 | smd 1 x 2: S1 -1.4,-3.1; S2 1.4,-3.1 | drill 0.65 long: S3 -4.32,0.725; S4 4.32,0.725 | drill 0.65 pad 1.2 long: S5 -4.32,-3.1; S6 4.32,-3.1 | hole 0.6: 3,0 | hole 0.63: 3,0; -3,0

### Placement (x,y rotation side)
4MHZ  29.84,29.37 0 top
ALU_Y_C0  11.11,25.08 270 top
ALU_Y_C1  5.71,28.89 270 top
C1  45.72,83.19 180 bottom
C2  74.14,69.22 90 top
C3  34.13,78.58 0 top
C4  27.3,62.55 90 bottom
C5  48.58,62.55 90 bottom
C6  69.85,62.39 90 bottom
C7  53.18,30.64 180 bottom
C8  53.34,20 180 bottom
C9  59.53,6.35 180 top
C10  73.34,73.18 0 top
C11  48.9,86.84 270 top
C12  74.45,84.77 0 top
C13  60.96,86.84 0 top
C14  47.78,75.88 90 bottom
C15  59.37,76.83 90 bottom
C16  12.06,54.13 270 top
C17  9.84,64.61 90 top
C18  40.32,26.51 0 top
C19  26.51,94.14 180 top
C20  45.4,93.82 0 top
C21  42.55,30.48 90 bottom
C22  33.97,66.2 180 bottom
C23  68.9,79.06 180 bottom
C24  19.68,25.08 90 top
IC1  66.83,69.37 270 top
IC2  55.56,69.37 270 top
IC3  45.56,85.57 0 top
IC4  66.83,81.44 270 top
IC5  45.56,78.74 0 top
IC6  43.5,69.37 270 top
IC7  41.43,85.57 0 top
IC8  48.42,30.64 180 top
IC9  48.42,20 180 top
IC10  41.43,78.9 0 top
IC11  12.06,59.69 0 top
IC12  29.37,74.14 0 top
IC13  34.13,67.31 0 top
IC14  80.17,70.01 270 top
IC15  61.59,94.77 270 top
IC16  34.13,74.14 0 top
IC19  55.56,81.44 270 top
INS_C0  94.3,22.54 270 top
INS_C1  88.9,25.08 270 top
JP3  59.85,24.77 270 top
LED1  62.55,3.02 230 top
LED2  66.04,3.02 230 top
LED3  69.53,3.02 230 top
LED4  73.03,3.02 230 top
LED5  76.68,2.86 230 top
LED6  32.07,96.36 90 top
LED7  30.32,96.36 90 top
LED8  33.81,96.36 90 top
OS1  36.83,31.43 180 top
PWR1  5.71,90.17 90 top
PWR2  31.11,24.45 0 top
PWR_C0  80.33,89.06 0 top
R1  7.62,64.61 270 top
R2  29.69,66.04 0 top
R3  64.14,8.89 270 bottom
R4  67.63,8.89 270 bottom
R5  71.12,8.89 270 bottom
R6  74.61,8.89 270 bottom
R7  78.26,8.89 270 bottom
R8  35.88,82.87 90 bottom
R9  33.81,91.92 90 bottom
R10  32.7,82.87 90 bottom
R11  31.75,91.92 90 bottom
R12  29.53,82.87 90 bottom
R13  29.69,91.92 90 bottom
R14  5.71,55.24 180 top
R16  66.67,17.94 270 bottom
R18  70.17,17.94 270 bottom
R20  73.66,17.94 270 bottom
RTB_BUS_C0  88.9,74.92 270 top
RTB_BUS_C1  94.3,74.92 270 top
S1  2.38,61.91 270 top
SIGNALS_C1  76.52,94.46 0 top
SINGNALS_C0  82.23,46.99 270 top
SJ1  39.37,28.57 270 bottom
T1  31.75,87.47 0 bottom
T2  34.92,87.47 0 bottom
T3  28.57,87.47 0 bottom
T5  67.63,13.97 180 bottom
T6  71.12,13.97 180 bottom
T7  74.61,13.97 180 bottom
U1  25.08,52.07 0 top
U2  46.35,51.91 0 top
U3  67.31,51.91 0 top
U$2  24.45,8.1 180 top
U$4  37.94,8.1 180 top
USB-C  50,5.71 0 top

### Tracks (layer width: path | path; a pad name or v marks a point on that pad's centre or on a via)
#ALU_G  (via drill 0.35)
  Top 0.152: SINGNALS_C0.7 v66.99,50.8 | v66.67,58.23 60.67,58.23 60.33,58.58 v51.44,58.58 | v50.8,78.9 IC19.6
  Bottom 0.152: v66.67,58.23 66.99,57.92 v66.99,50.8 | v51.44,58.58 51.44,78.26 v50.8,78.9
#ALU_SRC_IMM
  Top 0.152: IC15.4 67.15,93.82 67.63,94.3 82.71,94.3 SIGNALS_C1.14
#ALU_SRC_RF  (via drill 0.35)
  Top 0.152: v83.5,64.29 82.87,64.93 80.8,64.93 80.47,64.6 62.22,64.6 v61.91,64.9 | v61.91,82.71 IC4.3
  Bottom 0.152: SINGNALS_C0.2 v83.5,64.29 | v61.91,64.9 v61.91,82.71
#CLK  (via drill 0.35)
  Top 0.152: v49.85,83.98 IC19.2 | v49.85,70.01 44.13,70.01 43.5,70.64 IC6.3
  Bottom 0.152: v49.85,70.01 v49.85,83.98
#CU_RESET  (via drill 0.35)
  Top 0.152: IC2.13 60.96,71.91 v61.12,72.07 | v61.12,74.93 56.83,74.93 56.52,74.61 54.13,74.61 53.49,75.26 35.26,75.26 IC16.4
  Bottom 0.152: v61.12,72.07 v61.12,74.93
#IMM_RTB_G  (via drill 0.35)
  Top 0.152: v81.28,71.91 IC14.14
  Bottom 0.152: SIGNALS_C1.13 86.2,91.12 86.2,79.53 83.34,76.68 83.34,74.77 81.28,72.71 v81.28,71.91
#PC_RTB_G  (via drill 0.35)
  Top 0.152: v81.28,70.64 IC14.13
  Bottom 0.152: SIGNALS_C1.12 83.03,94.3 83.03,75.09 80.64,72.71 80.64,71.28 v81.28,70.64
#PRG_EN
  Top 0.152: IC4.12 66.2,82.71 65.56,83.34 56.04,83.34 54.13,81.44 IC19.4
#REG_RTB_G  (via drill 0.35)
  Top 0.152: v86.36,72.39 86.36,72.45 85.62,73.18 IC14.15
  Bottom 0.152: v86.36,72.39 86.36,51.12 SINGNALS_C0.10
#RF_STR  (via drill 0.35)
  Top 0.152: IC4.10 67.31,80.17 66.04,81.44 IC4.4 v61.28,81.44 | v61.28,77.63 IC19.8
  Bottom 0.152: v61.28,81.44 v61.28,77.63
ALU_G  (via drill 0.35)
  Top 0.152: v46.51,81.28 49.85,81.28 50.96,80.17 IC19.5
  Bottom 0.152: U2.17 46.35,48.1 46.35,81.12 v46.51,81.28
ALU_OP_0  (via drill 0.35)
  Top 0.152: SINGNALS_C0.18 82.23,39.37 v18.73,39.37
  Bottom 0.152: v18.73,39.37 U1.13
ALU_OP_1  (via drill 0.35)
  Top 0.152: SINGNALS_C0.16 82.23,41.91 v27.62,41.91
  Bottom 0.152: v27.62,41.91 27.62,45.72 U1.19
ALU_SRC  (via drill 0.35)
  Top 0.152: U2.20 v55.72,44.29 | v60.48,85.25 IC4.1 IC4.2 | IC15.2 v61.59,94.77
  Bottom 0.152: v55.72,44.29 55.72,60.8 57.94,63.02 57.94,82.71 v60.48,85.25 61.59,86.36 v61.59,94.77
ALU_Y_0
  Top 0.152: ALU_Y_C1.7 5.71,45.4 8.57,45.4 ALU_Y_C0.1
ALU_Y_1
  Top 0.152: ALU_Y_C1.8 8.1,43.02 11.27,43.02 ALU_Y_C0.2
ALU_Y_2
  Top 0.152: ALU_Y_C0.3 8.72,42.72 5.57,42.72 ALU_Y_C1.9
ALU_Y_3
  Top 0.152: ALU_Y_C1.10 8.1,40.48 11.27,40.48 ALU_Y_C0.4
ALU_Y_4
  Top 0.152: ALU_Y_C0.5 8.72,40.18 5.57,40.18 ALU_Y_C1.11
ALU_Y_5
  Top 0.152: ALU_Y_C1.12 8.1,37.94 11.27,37.94 ALU_Y_C0.6
ALU_Y_6
  Top 0.152: ALU_Y_C0.7 8.72,37.64 5.57,37.64 ALU_Y_C1.13
ALU_Y_7
  Top 0.152: ALU_Y_C1.14 8.1,35.4 11.27,35.4 ALU_Y_C0.8
ALU_Y_8
  Top 0.152: ALU_Y_C0.9 8.72,35.1 5.57,35.1 ALU_Y_C1.15
ALU_Y_9
  Top 0.152: ALU_Y_C1.16 8.1,32.86 11.27,32.86 ALU_Y_C0.10
ALU_Y_10
  Top 0.152: ALU_Y_C0.11 8.72,32.56 5.57,32.56 ALU_Y_C1.17
ALU_Y_11
  Top 0.152: ALU_Y_C1.18 8.1,30.32 11.27,30.32 ALU_Y_C0.12
ALU_Y_12
  Top 0.152: ALU_Y_C0.13 8.72,30.02 5.57,30.02 ALU_Y_C1.19
ALU_Y_13
  Top 0.152: ALU_Y_C1.20 8.1,27.78 11.27,27.78 ALU_Y_C0.14
ALU_Y_14
  Top 0.152: ALU_Y_C0.15 8.72,27.48 5.57,27.48 ALU_Y_C1.21
ALU_Y_15
  Top 0.152: ALU_Y_C1.22 8.1,25.24 11.27,25.24 ALU_Y_C0.16
ALU_Y_16
  Top 0.152: ALU_Y_C0.17 8.72,24.94 5.57,24.94 ALU_Y_C1.23
ALU_Y_17
  Top 0.152: ALU_Y_C1.24 8.1,22.7 11.27,22.7 ALU_Y_C0.18
ALU_Y_18
  Top 0.152: ALU_Y_C0.19 8.72,22.4 5.57,22.4 ALU_Y_C1.25
ALU_Y_19
  Top 0.152: ALU_Y_C1.26 8.1,20.16 11.27,20.16 ALU_Y_C0.20
ALU_Y_20
  Top 0.152: ALU_Y_C0.21 8.72,19.86 5.57,19.86 ALU_Y_C1.27
ALU_Y_21
  Top 0.152: ALU_Y_C1.28 8.1,17.62 11.27,17.62 ALU_Y_C0.22
ALU_Y_22
  Top 0.152: ALU_Y_C0.23 8.72,17.32 5.57,17.32 ALU_Y_C1.29
ALU_Y_23
  Top 0.152: ALU_Y_C1.30 8.1,15.08 11.27,15.08 ALU_Y_C0.24
ALU_Y_24
  Top 0.152: ALU_Y_C0.25 8.72,14.78 5.57,14.78 ALU_Y_C1.31
ALU_Y_25
  Top 0.152: ALU_Y_C1.32 8.1,12.54 11.27,12.54 ALU_Y_C0.26
ALU_Y_26
  Top 0.152: ALU_Y_C0.27 8.72,12.24 5.57,12.24 ALU_Y_C1.33
ALU_Y_27
  Top 0.152: ALU_Y_C1.34 8.1,10 11.27,10 ALU_Y_C0.28
ALU_Y_28
  Top 0.152: ALU_Y_C0.29 8.72,9.7 5.57,9.7 ALU_Y_C1.35
ALU_Y_29
  Top 0.152: ALU_Y_C1.36 8.1,7.46 11.27,7.46 ALU_Y_C0.30
ALU_Y_30
  Top 0.152: ALU_Y_C0.31 8.72,7.16 5.57,7.16 ALU_Y_C1.37
ALU_Y_31
  Top 0.152: ALU_Y_C1.38 8.26,4.76 11.11,4.76 ALU_Y_C0.32
BRANCH
  Bottom 0.152: SIGNALS_C1.11 82.71,92.08 82.71,75.25 80.17,72.71 80.17,62.39 78.11,60.33 78.11,43.5 SINGNALS_C0.15
CLK  (via drill 0.35)
  Top 0.152: IC4.5 60.64,80.17 60.01,80.8 v55.56,80.8 | v55.56,85.25 IC19.1 | v84.93,76.36 v73.98,76.36 70.17,76.36 69.37,75.56 55.88,75.56 v55.56,75.25 55.24,75.56 42.07,75.56 v41.59,76.04 | IC10.2 41.43,78.74 v41.59,78.9 | v82.71,30.48 v73.5,30.48 | IC6.11 43.18,69.37 v42.55,70.01 | IC4.11 v73.98,81.44
  Bottom 0.152: v55.56,85.25 v55.56,80.8 v55.56,75.25 | v84.93,76.36 84.93,52.23 SINGNALS_C0.8 82.23,49.53 82.23,34.45 82.71,33.97 v82.71,30.48 | v41.59,78.9 v41.59,76.04 42.55,75.09 v42.55,70.01 | SIGNALS_C1.5 v73.98,81.44 v73.98,76.36 | v73.5,30.48 73.5,19.05 R20.1
CLK_LOCAL  (via drill 0.35)
  Top 0.152: v54.93,69.37 IC2.11 | IC10.4 42.38,79.22 42.86,78.74 45.24,78.74 45.56,78.42 IC5.2 45.56,76.83 45.88,76.52 v53.82,76.52
  Bottom 0.152: v54.93,69.37 53.82,70.48 v53.82,76.52
CTR_0  (via drill 0.35)
  Top 0.152: U1.12 22.38,48.42 v36.83,48.42 42.55,48.42 | 42.55,48.42 62.55,48.42 U3.12 v65.25,49.37 | U2.12 42.55,48.42 | IC1.5 v65.72,68.1
  Bottom 0.152: v65.72,68.1 65.72,61.28 64.93,60.48 64.93,49.69 v65.25,49.37 | R8.1 35.88,80.65 36.83,79.69 v36.83,48.42
CTR_1  (via drill 0.35)
  Top 0.152: U1.11 19.68,50.48 36.2,50.48 | 40.01,50.48 59.85,50.48 U3.11 61.91,49.37 63.18,50.64 65.09,50.64 66.36,51.91 v67.79,51.91 | 40.01,50.48 36.2,50.48 | U2.11 40.01,50.48 | IC1.9 68.48,66.83 67.53,65.88 v66.83,65.88 | v36.2,49.85 36.2,50.48
  Bottom 0.152: v67.79,51.91 67.3,52.4 67.3,60.34 66.83,60.8 v66.83,65.88 | R10.1 32.7,80.64 34.13,79.22 36.52,76.82 36.52,71.75 36.52,66.52 36.52,50.18 v36.2,49.85
CTR_2  (via drill 0.35)
  Top 0.152: U3.10 62.39,50.8 42.55,50.8 | U1.10 22.54,50.8 42.55,50.8 | U2.10 42.55,50.8 | IC2.5 50.48,68.1 49.85,67.47 v43.81,67.47 43.18,67.47 41.91,68.74 39.21,68.74 37.78,70.17 v35.92,70.17
  Bottom 0.152: U2.10 43.81,53.18 v43.81,67.47 | v35.92,70.17 36.22,70.47 36.22,76.17 30.48,81.92 R12.1
CTR_#RST  (via drill 0.35)
  Top 0.152: IC1.13 68.1,71.91 66.83,73.18 65.56,73.18 IC1.1 61.12,73.18 60.48,72.55 54.77,72.55 54.13,73.18 IC2.1 52.39,73.28 v52.39,74.14 | IC3.4 52.36,86.87 v52.39,86.84
  Bottom 0.152: v52.39,86.84 v52.39,74.14
CTR_EN  (via drill 0.35)
  Top 0.152: IC5.4 49.02,80.04 v49.05,80.01 | v49.05,71.28 61.44,71.28 62.07,70.64 IC1.3
  Bottom 0.152: v49.05,80.01 v49.05,71.28
CU_RESET  (via drill 0.35)
  Top 0.152: IC10.1 v40.48,78.9 | v40.48,85.57 v40.48,85.56 IC7.1 | IC16.2 34.13,73.82 34.45,74.14 v40.48,74.14 | IC6.9 42.86,66.83 v42.23,67.47
  Bottom 0.152: v40.48,85.57 v40.48,78.9 v40.48,74.14 40.48,69.22 v42.23,67.47
DIV2
  Top 0.152: IC8.5 47.15,35.56 47.62,36.04 52.55,36.04 58.58,30 JP3.1
DIV4
  Top 0.152: IC8.9 45.88,26.04 46.35,25.56 56.99,25.56 57.47,26.04 JP3.3
DIV8
  Top 0.152: IC9.5 47.15,24.45 47.62,24.92 57.15,24.92 JP3.5
DIV16
  Top 0.152: IC9.9 45.88,19.05 46.83,20 57.63,20 JP3.7
DIVIDER_CLK
  Top 0.152: IC8.3 49.69,31.75 48.9,30.96 36.04,30.96 34.45,29.37 4MHZ.TP 34.29,29.37 OS1.3
GND  (via drill 0.35)
  other vias: 83.98,78.74 80.8,81.6 81.28,66.36 74.93,65.56 74.14,71.75 50.48,64.29 52.39,64.29 60.64,64.93 45.09,64.14 42.7,64.14 40.32,64.14 35.24,64.14 27.15,67.47 31.75,67.79 31.11,83.82 34.29,83.82 22.23,88.11 22.23,84.61 23.81,93.98 13.49,88.27 11.91,88.27 11.91,84.45 13.49,84.45 17.78,84.45 17.78,83.03 25.72,80.8 35.4,59.53 35.4,56.99 35.4,54.45 35.4,51.91 39.85,59.37 44.93,54.61 47.62,54.61 47.62,51.91 44.93,51.91 44.93,49.37 47.62,49.37 23.81,54.61 26.67,54.61 26.83,51.91 23.81,51.91 23.81,49.53 26.83,49.53 31.43,45.24 31.43,43.02 34.29,43.02 38.89,43.02 46.35,45.56 53.02,43.34 60.96,44.29 68.58,49.37 66.04,54.61 68.26,54.77 52.7,59.85 56.83,59.85 60.33,59.85 87.63,53.98 82.39,60.8 80.33,60.8 77.47,40.32 75.56,40.32 73.34,40.32 70.96,40.32 68.58,40.32 65.25,40.32 60.48,40.32 56.2,40.32 50.16,40.32 47.31,40.32 36.51,40.32 31.59,40.32 27.62,40.32 24.13,40.32 17.78,40.32 13.81,40.32 12.06,51.44 13.02,56.83 6.03,67.47 13.97,66.67 17.78,66.67 18.73,58.9 36.83,33.5 34.29,31.43 34.29,36.2 44.61,35.56 43.18,33.66 44.61,20 44.61,25.4 61.59,11.27 59.21,11.27 61.59,14.76 59.21,14.76 75.09,28.57 78.42,28.57 82.71,28.57 91.44,40.32 95.57,6.67 86.36,7.3 76.36,83.03 68.74,91.12 58.42,94.77 38.42,93.34 19.68,16.67 19.68,24.92 21.91,20.8 18.41,16.67 18.57,24.92 20.95,24.92 49.05,11.43 50.96,11.43 53.34,11.43 46.51,11.43 41.75,15.08 41.75,16.19
  pour Bottom: -6.83,108.58 109.86,108.58 109.86,51.44 109.86,-12.7 27.78,-12.7 -6.83,-12.7
  pour Top: -8.1,109.86 111.12,109.86 111.12,67.47 111.12,-18.1 3.17,-18.1 -8.1,-18.1
HLT
  Top 0.152: IC5.1 44.61,76.36 45.09,75.88 69.22,75.88 69.91,76.58 IC4.8
IMM_GEN_CTR_0  (via drill 0.35)
  Top 0.152: SIGNALS_C1.2 67.94,96.68 43.97,96.68 40.64,93.34 v39.37,93.34
  Bottom 0.152: U2.13 38.42,48.42 38.42,65.88 39.37,66.83 v39.37,93.34
IMM_GEN_CTR_1  (via drill 0.35)
  Top 0.152: v40.16,93.98 40.21,93.98 43.21,96.98 70.18,96.98 SIGNALS_C1.4
  Bottom 0.152: U2.14 41.27,45.56 41.27,65.56 39.67,67.16 39.67,91.75 40.16,92.23 v40.16,93.98
IMM_GEN_CTR_2  (via drill 0.35)
  Top 0.152: U3.18 67.15,42.86 57.31,42.86 v56.67,43.5 | SIGNALS_C1.6 72.87,94.61 v65.41,94.61
  Bottom 0.152: v56.67,43.5 56.67,57.94 65.25,66.52 65.25,67.72 65.12,67.85 65.12,68.36 65.41,68.64 v65.41,94.61
INS_0  (via drill 0.35)
  Top 0.152: U3.9 59.69,53.18 40.01,53.18 | U1.9 19.84,53.18 40.01,53.18 | U2.9 40.01,53.18 | INS_C1.1 85.57,44.13 84.77,43.34 84.77,34.92 83.98,34.13 v61.91,34.13
  Bottom 0.152: v61.91,34.13 61.91,50.96 U3.9
INS_1  (via drill 0.35)
  Top 0.152: U3.8 62.55,53.5 42.55,53.5 | U1.8 22.38,53.5 42.55,53.5 | U2.8 42.55,53.5 | INS_C1.2 88.9,42.86 86.04,42.86 85.08,41.9 85.08,34.8 83.8,33.52 v62.87,33.52
  Bottom 0.152: v62.87,33.52 62.87,36.83 62.38,37.32 62.38,53.33 U3.8
INS_2  (via drill 0.35)
  Top 0.152: U3.7 59.68,55.73 40.01,55.73 | U1.7 19.86,55.73 40.01,55.73 | U2.7 40.01,55.73 | INS_C1.3 86.04,41.59 85.38,40.93 85.38,34.67 83.63,32.92 60.05,32.92 59.37,33.59 v59.37,34.13
  Bottom 0.152: v59.37,34.13 59.37,52.86 U3.7
INS_3  (via drill 0.35)
  Top 0.152: U3.6 62.55,56.04 42.55,56.04 | U1.6 22.38,56.04 42.55,56.04 | U2.6 42.55,56.04 | INS_C1.4 88.9,40.32 86.52,40.32 85.69,39.49 85.69,34.55 83.75,32.61 59.4,32.61 58.42,33.59 v58.42,34.13
  Bottom 0.152: v58.42,34.13 58.42,53.66 60.48,55.72 62.23,55.72 U3.6
INS_4  (via drill 0.35)
  Top 0.152: U3.5 60.01,57.94 40.01,57.94 | U1.5 19.78,58.2 32.12,58.2 32.37,57.94 40.01,57.94 | U2.5 40.01,57.94 | INS_C1.5 86.52,39.05 85.99,38.52 85.99,34.42 83.88,32.31 58.86,32.31 57.51,33.66 v57.51,34.13
  Bottom 0.152: v57.51,34.13 57.51,53.54 U3.5
INS_5  (via drill 0.35)
  Top 0.152: INS_C1.6 88.9,37.78 86.68,37.78 86.3,37.4 86.3,34.29 83.7,31.7 v72.07,31.7 58.95,31.7 51.91,38.73 v51.44,38.73 v32.7,38.73
  Bottom 0.152: v72.07,31.7 72.07,52.86 U3.27 | v51.44,38.73 51.44,53.18 U2.27 | v32.7,38.73 32.7,53.34 U1.27
INS_6  (via drill 0.35)
  Top 0.152: v30.16,38.58 31.59,38.58 32.04,38.13 v48.9,38.13 52.07,38.13 59.1,31.09 v69.85,31.09 83.96,31.09 v86.2,33.34
  Bottom 0.152: v69.85,31.09 70.01,31.25 70.01,50.01 71.12,51.12 U3.26 | v48.9,38.13 48.9,50.64 U2.26 | v30.16,38.58 30.16,50.64 28.89,51.91 U1.26 | INS_C1.7 86.2,35.08 v86.2,33.34
INS_F3_0
  Top 0.152: INS_C0.7 91.92,27.78 88.74,27.78 INS_C1.13
INS_F3_1
  Top 0.152: INS_C1.14 91.29,30.02 94.44,30.02 INS_C0.8
INS_F3_2
  Top 0.152: INS_C0.9 91.92,25.24 88.74,25.24 INS_C1.15
INS_I
  Top 0.152: INS_C0.20 94.3,12.38 92.23,12.38 91.6,11.75 91.6,8.1 90.81,7.3 88.9,7.3 INS_C1.31
INS_R1_0
  Top 0.152: INS_C1.16 91.29,27.48 94.44,27.48 INS_C0.10
INS_R1_1
  Top 0.152: INS_C0.11 91.92,22.7 88.74,22.7 INS_C1.17
INS_R1_2
  Top 0.152: INS_C1.18 91.29,24.94 94.44,24.94 INS_C0.12
INS_R1_3
  Top 0.152: INS_C0.13 91.92,20.16 88.74,20.16 INS_C1.19
INS_R1_4
  Top 0.152: INS_C1.20 91.29,22.4 94.44,22.4 INS_C0.14
INS_R2_0
  Top 0.152: INS_C0.15 91.92,17.62 88.74,17.62 INS_C1.21
INS_R2_1
  Top 0.152: INS_C1.22 91.29,19.86 94.44,19.86 INS_C0.16
INS_R2_2
  Top 0.152: INS_C0.17 91.92,15.08 88.74,15.08 INS_C1.23
INS_R2_3
  Top 0.152: INS_C1.24 91.29,17.32 94.44,17.32 INS_C0.18
INS_R2_4
  Top 0.152: INS_C0.19 91.92,12.54 88.74,12.54 INS_C1.25
INS_WR_0
  Bottom 0.152: INS_C1.8 91.44,37.78 94.3,37.78 INS_C0.2
INS_WR_1
  Top 0.152: INS_C0.3 91.92,32.86 88.74,32.86 INS_C1.9
INS_WR_2
  Top 0.152: INS_C0.4 94.3,35.24 91.44,35.24 INS_C1.10
INS_WR_3
  Top 0.152: INS_C1.11 88.74,30.32 91.92,30.32 INS_C0.5
INS_WR_4
  Top 0.152: INS_C0.6 94.46,32.54 91.28,32.54 INS_C1.12
INVALID_INS  (via drill 0.35)
  Top 0.152: LED5.A 75.09,2.97 v75.09,3.02 | v77.15,46.83 U3.21
  Bottom 0.152: v75.09,3.02 76.52,4.45 76.52,41.12 77.15,41.75 v77.15,46.83
LOCAL_RESET  (via drill 0.35)
  Top 0.152: S1.1 3.32,63.48 7.43,63.48 R1.2 C17.1 10,63.5 11.11,63.5 11.91,64.29 v24.45,64.29 33.5,64.29 34.13,64.93 IC13.2 | U$2.2 25.72,16.03 24.13,17.62 18.26,17.62 16.35,19.53 16.35,31.75 23.18,38.58 v25.72,38.58
  Bottom 0.152: v25.72,38.58 25.72,42.86 24.94,43.64 24.94,61.11 24.45,61.59 v24.45,64.29
LTCH_CLK  (via drill 0.35)
  Top 0.152: IC4.6 66.67,78.9 67.31,78.26 v75.56,78.26 | SINGNALS_C0.9 v75.72,48.26
  Bottom 0.152: v75.56,78.26 76.05,77.78 76.05,56.53 75.71,56.19 75.71,48.27 v75.72,48.26
M_RESET  (via drill 0.35)
  Top 0.152: v66.52,30.49 59.28,30.49 52.3,37.47 v37.62,37.47 | v38.58,68.1 IC6.5 | IC6.12 44.13,70.64 43.5,71.28 v38.58,71.28
  Bottom 0.152: v38.58,71.28 v38.58,68.1 38.58,67.31 37.62,66.36 v37.62,37.47 | R16.1 66.52,19.05 v66.52,30.49
MEM_LOAD  (via drill 0.35)
  Top 0.152: SINGNALS_C0.6 82.23,52.07 76.36,52.07 75.41,53.02 v66.2,53.02
  Bottom 0.152: v66.2,53.02 66.2,46.99 U3.17
MEM_STORE  (via drill 0.35)
  Top 0.152: v22.38,61.59 75.88,61.59 80.33,57.15 82.23,57.15 SINGNALS_C0.4
  Bottom 0.152: U1.14 22.38,45.56 22.38,61.44 v22.38,61.59
N$1  (via drill 0.35)
  Top 0.152: IC1.2 v66.83,71.91 | v66.83,66.83 IC1.6 | IC1.11 v66.83,69.37
  Bottom 0.152: v66.83,71.91 v66.83,69.37 v66.83,66.83
N$2
  Top 0.152: IC13.4 35.08,69.53 34.13,70.48 29.05,70.48 28.42,71.12 IC12.1
N$3  (via drill 0.35)
  Top 0.152: v41.43,83.03 IC7.2 | IC2.9 55.4,66.83 54.77,66.2 v43.18,66.2
  Bottom 0.152: v41.43,83.03 43.18,81.28 v43.18,66.2
N$4
  Top 0.152: IC7.4 42.38,86.05 42.86,85.57 45.24,85.57 45.56,85.25 IC3.2
N$5
  Top 0.152: IC19.12 IC19.11
N$6  (via drill 0.35)
  Top 0.152: IC8.11 v48.42,29.21 | v45.88,35.56 IC8.6 | IC8.2 v50.96,32.07
  Bottom 0.152: v48.42,29.21 48.42,32.07 | 48.42,32.07 48.42,33.02 v45.88,35.56 | v50.96,32.07 48.42,32.07
N$7  (via drill 0.35)
  Top 0.152: IC2.3 55.4,70.64 56.04,70.01 67.79,70.01 68.42,70.64 IC1.12 v71.75,70.64 | v71.75,65.56 IC1.8
  Bottom 0.152: v71.75,70.64 v71.75,65.56
N$8
  Bottom 0.152: T5.C R4.1
N$9  (via drill 0.35)
  Top 0.152: IC2.2 v50.8,71.91 | v50.8,66.83 IC2.6
  Bottom 0.152: v50.8,71.91 v50.8,66.83
N$10
  Bottom 0.152: R5.1 T6.C
N$11
  Bottom 0.152: T7.C R6.1
N$12  (via drill 0.35)
  Top 0.152: LED1.C 64.01,4.6 v64.14,4.6
  Bottom 0.152: v64.14,4.6 R3.2
N$14
  Bottom 0.152: R8.2 T2.B
N$15  (via drill 0.35)
  Top 0.152: v33.81,94.14 LED8.C
  Bottom 0.152: R9.2 v33.81,94.14
N$16  (via drill 0.35)
  Top 0.152: IC8.12 v49.69,30 45.56,30 44.61,29.05 IC8.8 | v49.69,21.27 IC9.3
  Bottom 0.152: v49.69,30 v49.69,21.27
N$17  (via drill 0.35)
  Top 0.152: LED2.C 66.84,3.82 v67.63,4.6
  Bottom 0.152: v67.63,4.6 R4.2
N$18  (via drill 0.35)
  Top 0.152: v71.12,4.6 70.34,3.82 LED3.C
  Bottom 0.152: v71.12,4.6 R5.2
N$19
  Bottom 0.152: T2.C 34.92,89.38 34.45,89.85 34.45,90.33 R9.1
N$20
  Bottom 0.152: T1.B R10.2
N$21  (via drill 0.35)
  Top 0.152: v31.75,94.14 31.75,94.99 LED6.C
  Bottom 0.152: R11.2 v31.75,94.14
N$22
  Bottom 0.152: T1.C R11.1
N$23
  Bottom 0.152: R12.2 T3.B
N$24  (via drill 0.35)
  Top 0.152: LED7.C 30.48,95.15 30.48,94.3 30.32,94.14 v29.69,94.14
  Bottom 0.152: R13.2 v29.69,94.14
N$25
  Bottom 0.152: T3.C 28.57,89.53 29.05,90.01 29.05,90.65 29.37,90.97 R13.1
N$26
  Bottom 0.152: R16.2 T5.B
N$27  (via drill 0.35)
  Top 0.152: LED4.C 74.48,4.6 v74.61,4.6
  Bottom 0.152: v74.61,4.6 R6.2
N$28  (via drill 0.35)
  Top 0.152: LED5.C 77.48,3.66 v78.26,4.45
  Bottom 0.152: v78.26,4.45 R7.2
N$29
  Bottom 0.152: R18.2 T6.B
N$30  (via drill 0.35)
  Top 0.152: IC9.11 48.42,18.73 | v47.62,18.73 48.42,18.73 | v45.88,24.77 IC9.6 | 48.42,18.73 v49.1,18.73 | v50.96,21.27 IC9.2
  Bottom 0.152: v47.62,18.73 47.62,23.02 v45.88,24.77 | v49.1,18.73 50.96,20.59 v50.96,21.27
N$31
  Top 0.152: IC9.8 44.61,15.56 44.93,15.24 49.37,15.24 49.69,15.56 IC9.12
N$32
  Bottom 0.152: R20.2 T7.B
N$33
  Top 0.152: R14.1 11.9,55.24 C16.1 IC11.2
N$34  (via drill 0.35)
  Top 0.152: v39.37,32.07 OS1.1
  Bottom 0.152: SJ1.1 v39.37,32.07
N$35  (via drill 0.35)
  Top 0.152: IC4.13 v71.75,83.98
  Bottom 0.152: v71.75,83.98 71.75,73.82 70.01,72.07 70.01,65.72 72.39,63.34 72.39,56.36 71.75,55.72 70.48,55.72 69.22,54.45 69.22,51.28 67.31,49.37 67.31,34.77 JP3.2 JP3.4 JP3.6 JP3.8
PC_SRC_0  (via drill 0.35)
  Top 0.152: SIGNALS_C1.8 74.95,97.29 41.25,97.29 32.86,88.9 v23.18,88.9
  Bottom 0.152: U1.17 22.69,48.11 22.69,60.79 23.18,61.28 v23.18,88.9
PC_SRC_1  (via drill 0.35)
  Top 0.152: SIGNALS_C1.10 77.19,97.59 41.12,97.59 33.06,89.53 v23.97,89.53 | U1.21 v33.5,46.99
  Bottom 0.152: v33.5,46.99 33.5,58.26 31.75,60.01 31.75,63.34 30.16,64.93 30.16,72.23 23.97,78.42 v23.97,89.53
PCE  (via drill 0.35)
  Top 0.152: IC2.12 v56.83,70.64 | v56.83,80.17 IC19.10 | v81.44,64.29 77.67,64.29 v77.15,63.78 57.67,63.78 57.47,63.98 v56.83,63.98
  Bottom 0.152: v56.83,80.17 v56.83,70.64 v56.83,63.98 | SINGNALS_C0.1 80.96,59.69 81.44,60.17 v81.44,64.29 | SIGNALS_C1.7 74.45,91.12 74.45,82.87 77.31,80.01 77.31,63.94 v77.15,63.78
PCE_LOCAL  (via drill 0.35)
  Top 0.152: U2.18 49.05,45.72 v54.93,45.72 | v56.83,83.98 IC19.13
  Bottom 0.152: v54.93,45.72 54.93,60.48 57.63,63.18 57.63,83.19 v56.83,83.98
PREP_RESET  (via drill 0.35)
  Top 0.152: IC6.2 39.21,71.91 39.05,72.07 38.1,72.07 37.47,71.44 v31.75,71.44 | v31.75,75.41 30.35,75.41 IC12.4
  Bottom 0.152: v31.75,71.44 v31.75,75.41
PRG_EN  (via drill 0.35)
  Top 0.152: v75.09,62.23 54,62.23 v53.98,62.2 v30.16,62.2 | v72.71,91.12 70.96,91.12 SIGNALS_C1.1 65.09,93.19 64.77,92.87 51.12,92.87 v50.8,93.19 | v50.8,82.71 IC19.3
  Bottom 0.152: v53.98,62.2 53.98,50.64 U2.23 | v30.16,62.2 30.16,51.12 31.43,49.85 U1.23 | v72.71,91.12 72.71,64.61 v75.09,62.23 75.09,56.52 74.77,56.2 74.77,50.48 U3.23 74.61,48.42 74.61,32.86 70.01,28.25 70.01,19.05 R18.1 | v50.8,93.19 v50.8,82.71
PRG_RESET  (via drill 0.35)
  Top 0.152: v37.47,67.31 33.81,67.31 33.18,66.68 IC13.1 33.16,66.04 R2.2 | v37.94,88.58 38.73,89.38 64.61,89.38 67.79,86.2 v75.25,86.2
  Bottom 0.152: v37.94,88.58 37.47,88.11 v37.47,67.31 | PWR_C0.2 75.25,89.06 v75.25,86.2
RC_RESET  (via drill 0.35)
  Top 0.152: IC12.2 v29.37,71.44 | v31.43,59.05 30.96,58.58 20.32,58.58 17.91,60.99 IC11.4
  Bottom 0.152: v29.37,71.44 29.37,64.93 31.43,62.87 v31.43,59.05
RF_LOAD  (via drill 0.35)
  Top 0.152: SINGNALS_C0.3 80.8,55.72 v64.29,55.72
  Bottom 0.152: U3.15 64.61,47.94 64.61,55.4 v64.29,55.72
RF_STR  (via drill 0.35)
  Top 0.152: v43.97,42.55 v76.36,42.55 | v76.36,53.34 SINGNALS_C0.5 | v76.36,79.53 60.8,79.53 60.17,78.9 IC19.9
  Bottom 0.152: U2.15 43.81,45.56 43.81,42.7 v43.97,42.55 | v76.36,42.55 v76.36,53.34 v76.36,79.53
RST  (via drill 0.35)
  Top 0.152: SIGNALS_C1.3 72.87,91.76 v77.79,91.76
  Bottom 0.152: v77.79,91.76 77.79,41.27 SINGNALS_C0.17
RTB_0
  Top 0.152: RTB_BUS_C0.1 88.91,95.25 91.75,95.25 RTB_BUS_C1.1
RTB_1
  Top 0.152: RTB_BUS_C0.2 91.27,92.87 94.47,92.87 RTB_BUS_C1.2
RTB_2
  Top 0.152: RTB_BUS_C1.3 91.89,92.56 88.77,92.56 RTB_BUS_C0.3
RTB_3
  Top 0.152: RTB_BUS_C0.4 91.27,90.33 94.47,90.33 RTB_BUS_C1.4
RTB_4
  Top 0.152: RTB_BUS_C1.5 91.89,90.02 88.77,90.02 RTB_BUS_C0.5
RTB_5
  Top 0.152: RTB_BUS_C0.6 91.27,87.79 94.47,87.79 RTB_BUS_C1.6
RTB_6
  Top 0.152: RTB_BUS_C1.7 91.89,87.48 88.77,87.48 RTB_BUS_C0.7
RTB_7
  Top 0.152: RTB_BUS_C0.8 91.27,85.25 94.47,85.25 RTB_BUS_C1.8
RTB_8
  Top 0.152: RTB_BUS_C1.9 91.89,84.94 88.77,84.94 RTB_BUS_C0.9
RTB_9
  Top 0.152: RTB_BUS_C0.10 91.27,82.71 94.47,82.71 RTB_BUS_C1.10
RTB_10
  Top 0.152: RTB_BUS_C1.11 91.89,82.4 88.77,82.4 RTB_BUS_C0.11
RTB_11
  Top 0.152: RTB_BUS_C0.12 91.27,80.17 94.47,80.17 RTB_BUS_C1.12
RTB_12
  Top 0.152: RTB_BUS_C1.13 91.89,79.86 88.77,79.86 RTB_BUS_C0.13
RTB_13
  Top 0.152: RTB_BUS_C0.14 91.27,77.63 94.47,77.63 RTB_BUS_C1.14
RTB_14
  Top 0.152: RTB_BUS_C1.15 91.89,77.32 88.77,77.32 RTB_BUS_C0.15
RTB_15
  Top 0.152: RTB_BUS_C0.16 91.27,75.09 94.47,75.09 RTB_BUS_C1.16
RTB_16
  Top 0.152: RTB_BUS_C1.17 91.89,74.78 88.77,74.78 RTB_BUS_C0.17
RTB_17
  Top 0.152: RTB_BUS_C0.18 91.27,72.55 94.47,72.55 RTB_BUS_C1.18
RTB_18
  Top 0.152: RTB_BUS_C1.19 91.89,72.24 88.77,72.24 RTB_BUS_C0.19
RTB_19
  Top 0.152: RTB_BUS_C0.20 91.27,70.01 94.47,70.01 RTB_BUS_C1.20
RTB_20
  Top 0.152: RTB_BUS_C1.21 91.89,69.7 88.77,69.7 RTB_BUS_C0.21
RTB_21
  Top 0.152: RTB_BUS_C0.22 91.27,67.47 94.47,67.47 RTB_BUS_C1.22
RTB_22
  Top 0.152: RTB_BUS_C1.23 91.89,67.16 88.77,67.16 RTB_BUS_C0.23
RTB_23
  Top 0.152: RTB_BUS_C0.24 91.27,64.93 94.47,64.93 RTB_BUS_C1.24
RTB_24
  Top 0.152: RTB_BUS_C1.25 91.89,64.62 88.77,64.62 RTB_BUS_C0.25
RTB_25
  Top 0.152: RTB_BUS_C0.26 91.27,62.39 94.47,62.39 RTB_BUS_C1.26
RTB_26
  Top 0.152: RTB_BUS_C1.27 91.89,62.08 88.77,62.08 RTB_BUS_C0.27
RTB_27
  Top 0.152: RTB_BUS_C0.28 91.27,59.85 94.47,59.85 RTB_BUS_C1.28
RTB_28
  Top 0.152: RTB_BUS_C1.29 91.89,59.54 88.77,59.54 RTB_BUS_C0.29
RTB_29
  Top 0.152: RTB_BUS_C0.30 91.27,57.31 94.47,57.31 RTB_BUS_C1.30
RTB_30
  Top 0.152: RTB_BUS_C1.31 91.89,57 88.77,57 RTB_BUS_C0.31
RTB_31
  Top 0.152: RTB_BUS_C0.32 91.43,54.61 94.31,54.61 RTB_BUS_C1.32
RTB_SEL_0  (via drill 0.35)
  Top 0.152: IC14.1 v78.9,74.45 | v79.53,63.66 78.42,63.66 77.93,63.17 21.1,63.17 v20,62.07
  Bottom 0.152: v78.9,74.45 79.53,73.82 v79.53,63.66 | v20,62.07 20,48.26 U1.15
RTB_SEL_1  (via drill 0.35)
  Top 0.152: IC14.2 v78.9,73.18 | v78.9,62.87 26.04,62.87 v25.4,62.23
  Bottom 0.152: v78.9,73.18 v78.9,62.87 | v25.4,62.23 25.24,62.07 25.24,45.56 U1.18
SH_BUSY  (via drill 0.35)
  Top 0.152: IC4.9 v74.77,78.9 | v75.72,44.61 82.07,44.61 SINGNALS_C0.14
  Bottom 0.152: v74.77,78.9 74.77,77.95 75.75,76.97 75.75,56.65 75.09,55.99 75.09,44.93 75.41,44.61 v75.72,44.61
SH_LOAD
  Top 0.152: SINGNALS_C0.12 82.23,46.99 80.33,46.99 79.05,45.71 62.08,45.71 U3.13
SH_LTCH
  Top 0.152: SINGNALS_C0.11 80.64,45.4 64.61,45.4 U3.14
SH_RTB_EN  (via drill 0.35)
  Top 0.152: v80.8,69.37 IC14.5
  Bottom 0.152: SINGNALS_C0.13 78.41,45.73 78.41,60.2 80.47,62.26 80.47,69.04 v80.8,69.37
TAKE_BRCH  (via drill 0.35)
  Top 0.152: U1.20 v34.29,44.45 | v80.33,96.84 79.27,97.9 41,97.9 33.27,90.17 v24.77,90.17
  Bottom 0.152: v34.29,44.45 34.29,57.9 32.05,60.13 32.05,63.47 30.47,65.06 30.47,72.36 24.77,78.06 v24.77,90.17 | v80.33,96.84 80.33,94.46 SIGNALS_C1.9
VCC  (via drill 0.35)
  Top 0.152: v14.61,86.36 16.03,86.36
  Top 0.305: U1.32 27.78,61.12 33.18,61.12 | U3.32 66.99,61.12 47.62,61.12 | 33.18,61.12 34.13,61.12 47.62,61.12 | U2.32 47.62,61.12 | IC2.14 58.74,73.18 | 58.74,73.18 60.17,73.18 60.96,73.98 67.31,73.98 v68.02,73.26 68.1,73.18 IC1.14 C10.1 | v44.61,88.27 v44.61,88.26 IC3.5 | IC7.5 40.48,87.79 40.96,88.27 v44.61,88.27 | IC5.5 44.61,81.12 v44.77,81.28 40.8,81.28 40.48,80.97 IC10.5 | IC14.16 81.28,74.45 80.01,75.72 75.64,75.72 74.84,74.93 v68.02,74.93 | 58.58,86.84 58.58,85.31 IC19.14 | IC15.5 v64.45,95.72 v64.45,95.73 | IC8.13 IC8.14 v52.23,29.21 | IC8.10 v47.15,29.21 | v47.15,31.85 47.88,31.85 48.42,32.38 IC8.4 48.42,35.08 48.74,35.4 51.91,35.4 52.23,35.08 IC8.1 v52.23,32.07 | v52.23,21.43 IC9.1 | IC9.4 v48.42,21.27 | IC9.10 47.15,18.1 v46.51,18.73 | IC9.13 IC9.14 v52.23,18.57 | PWR2.4 31.75,27.62 v36.35,27.62 38.06,29.33 OS1.4 | ALU_Y_C1.3 2.38,51.28 2.38,55.24 | 2.38,55.24 S1.2 | R14.2 2.38,55.24 | IC6.13 v44.77,71.91 | IC6.1 v44.77,73.18 IC6.14 v48.26,73.18 | IC6.4 42.07,69.37 42.7,68.74 44.13,68.74 v44.77,68.1 IC6.10 49.37,68.1 50.64,69.37 IC2.4 53.82,69.37 55.09,68.1 IC2.10 60.01,68.1 61.28,69.37 IC1.4 65.72,69.37 66.99,68.1 67.15,68.1 v67.94,68.1 IC1.10 73.97,68.1 C2.1 | IC12.5 28.42,76.52 28.73,76.83 v33.18,76.83 | IC16.5 v33.18,76.83 | v33.18,69.69 IC13.5 | C17.2 v15.87,65.56 v15.88,65.56 | IC11.5 11.12,61.91 11.75,62.55 v15.88,62.55 | v33.18,60.33 33.18,61.12 | LED8.A LED6.A LED7.A 29.47,97.41 27.46,95.41 C19.1 v27.46,91.92 | C12.1 72.39,84.77 71.91,85.25 IC4.14 v68.1,85.25 66.83,85.25 63.82,88.27 v60.01,88.27 v60.01,88.26 C13.1 58.58,86.84 | v58.74,74.3 58.74,73.18 | v44.61,88.27 47.15,88.27 47.63,87.79 C11.1 53.02,87.79 53.98,86.84 58.58,86.84
  Top 0.305: C2.1 | IC14.6 74.3,68.1 C2.1 | C3.1 v33.18,76.83 | LED1.A 60.48,3.6 C9.1 60.48,13.17 60.48,13.18 | OS1.4 C18.1 | OS1.4 40.76,29.33 v40.96,29.53 | C20.1 44.45,91.6 v44.61,91.44
  Top 0.508: LED1.A LED2.A LED3.A LED4.A | v52.23,13.18 52.2,13.14 52.35,12.99 USB-C.11 | USB-C.2 47.65,12.99 47.47,13.18
  Top 1.016: INS_C0.24 97.31,10.32 97.31,38.1 96.52,38.89 93.82,38.89 93.03,38.1 INS_C0.1
  Top 1.27: U$2.1 28.26,19.84 29.84,21.43 PWR2.3 PWR2.2 23.94,29.08 C24.+ 19.68,33.02 v19.84,33.18 | PWR1.1 PWR1.4
  Top 1.778: ALU_Y_C1.3 ALU_Y_C1.5 ALU_Y_C1.6 | 75.56,87.79 75.55,87.78 68.9,87.78 v68.1,88.58 65.25,91.44 v64.45,91.44 v60.01,91.44 v44.61,91.44 38.26,91.44 38.1,91.28 33.18,86.36 27.46,86.36 v26.19,86.36 16.03,86.36 PWR1.1 | 75.56,87.79 PWR_C0.1 | 75.56,87.79 PWR_C0.3 PWR_C0.4 PWR_C0.6 | INS_C0.24 INS_C0.23 93.03,5.56 91.44,3.97 85.25,3.97 v82.79,6.43 76.04,13.18 60.48,13.18 v52.23,13.18 v48.42,13.18 47.47,13.18 U$4.1
  Bottom 0.305: U1.31 U1.32 27.3,60.64 C4.1 | U2.31 U2.32 48.58,60.48 C5.1 | U3.31 U3.32 68.58,61.44 | 68.58,61.44 68.58,67.47 v67.94,68.1 68.02,68.18 v68.02,73.26 v68.02,74.93 67.95,75.01 C23.1 68.1,79.21 v68.1,85.25 v68.1,88.58 | v60.01,91.44 v60.01,88.27 | v64.45,95.73 v64.45,91.44 | v47.15,29.21 v47.15,31.85 | v48.42,21.27 48.42,17.62 | 48.42,17.62 v48.42,13.18 | v46.51,18.73 46.51,17.94 46.83,17.62 48.42,17.62 | v52.23,13.18 v52.23,18.57 52.23,19.84 C8.1 52.23,20.16 v52.23,21.43 v52.23,29.21 C7.1 v52.23,32.07 | v44.77,68.1 v44.77,71.91 v44.77,73.18 v44.77,81.28 C1.1 44.77,88.1 v44.61,88.27 v44.61,91.44 | SJ1.2 39.18,27.62 v36.35,27.62 | C14.1 47.78,73.66 v48.26,73.18 | C15.1 59.37,74.93 v58.74,74.3 | C6.1 68.58,61.44 | v27.46,91.92 27.46,89.22 26.19,87.95 v26.19,86.36 26.19,82.07 31.43,76.83 v33.18,76.83 v33.18,69.69 33.18,66.36 C22.1 33.18,66.04 v33.18,60.33 | v40.96,29.53 C21.1
  Bottom 1.27: SINGNALS_C0.19 80.96,8.26 v82.79,6.43
  Bottom 1.778: ALU_Y_C1.6 15.88,46.67 | U$4.1 39.21,15.72 36.67,18.26 33.02,18.26 29.84,21.43 PWR2.3 | PWR1.1 PWR1.2 | PWR1.4 PWR1.3 PWR1.1 | PWR1.1 v15.88,86.36 v15.88,65.56 15.88,64.77 v15.88,62.55 15.88,46.67 | PWR2.3 PWR2.4 PWR2.2 | PWR2.3 PWR2.1 PWR2.2 | 15.88,46.67 15.88,37.15 v19.84,33.18 PWR2.2

### Text on the board
tNames: μI | RESET | 2MHz | 1MHz | 500KHz | 250KHz | Power | Reset | Program | Clock | Error
bNames: CONTROL UNIT / SZKANDERA 2020